# EAGLE schematic Luminant Display Rev. 2.0 Build 5 (FINAL) (EAGLE 6.4), part 1 of 7
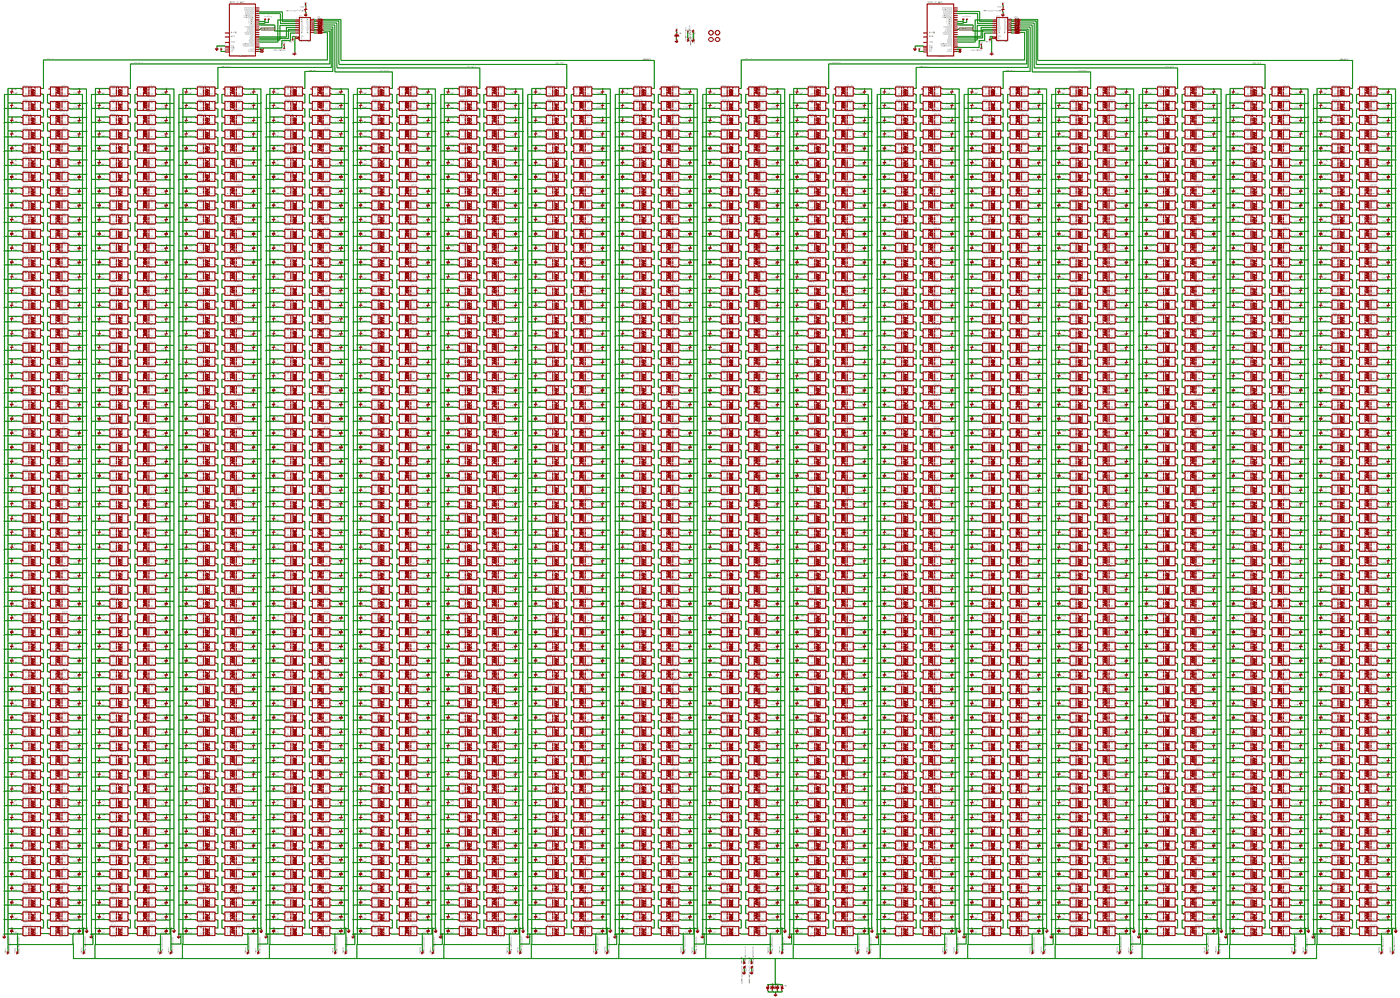
[diagram p0: schematic, sheet 1, overview]
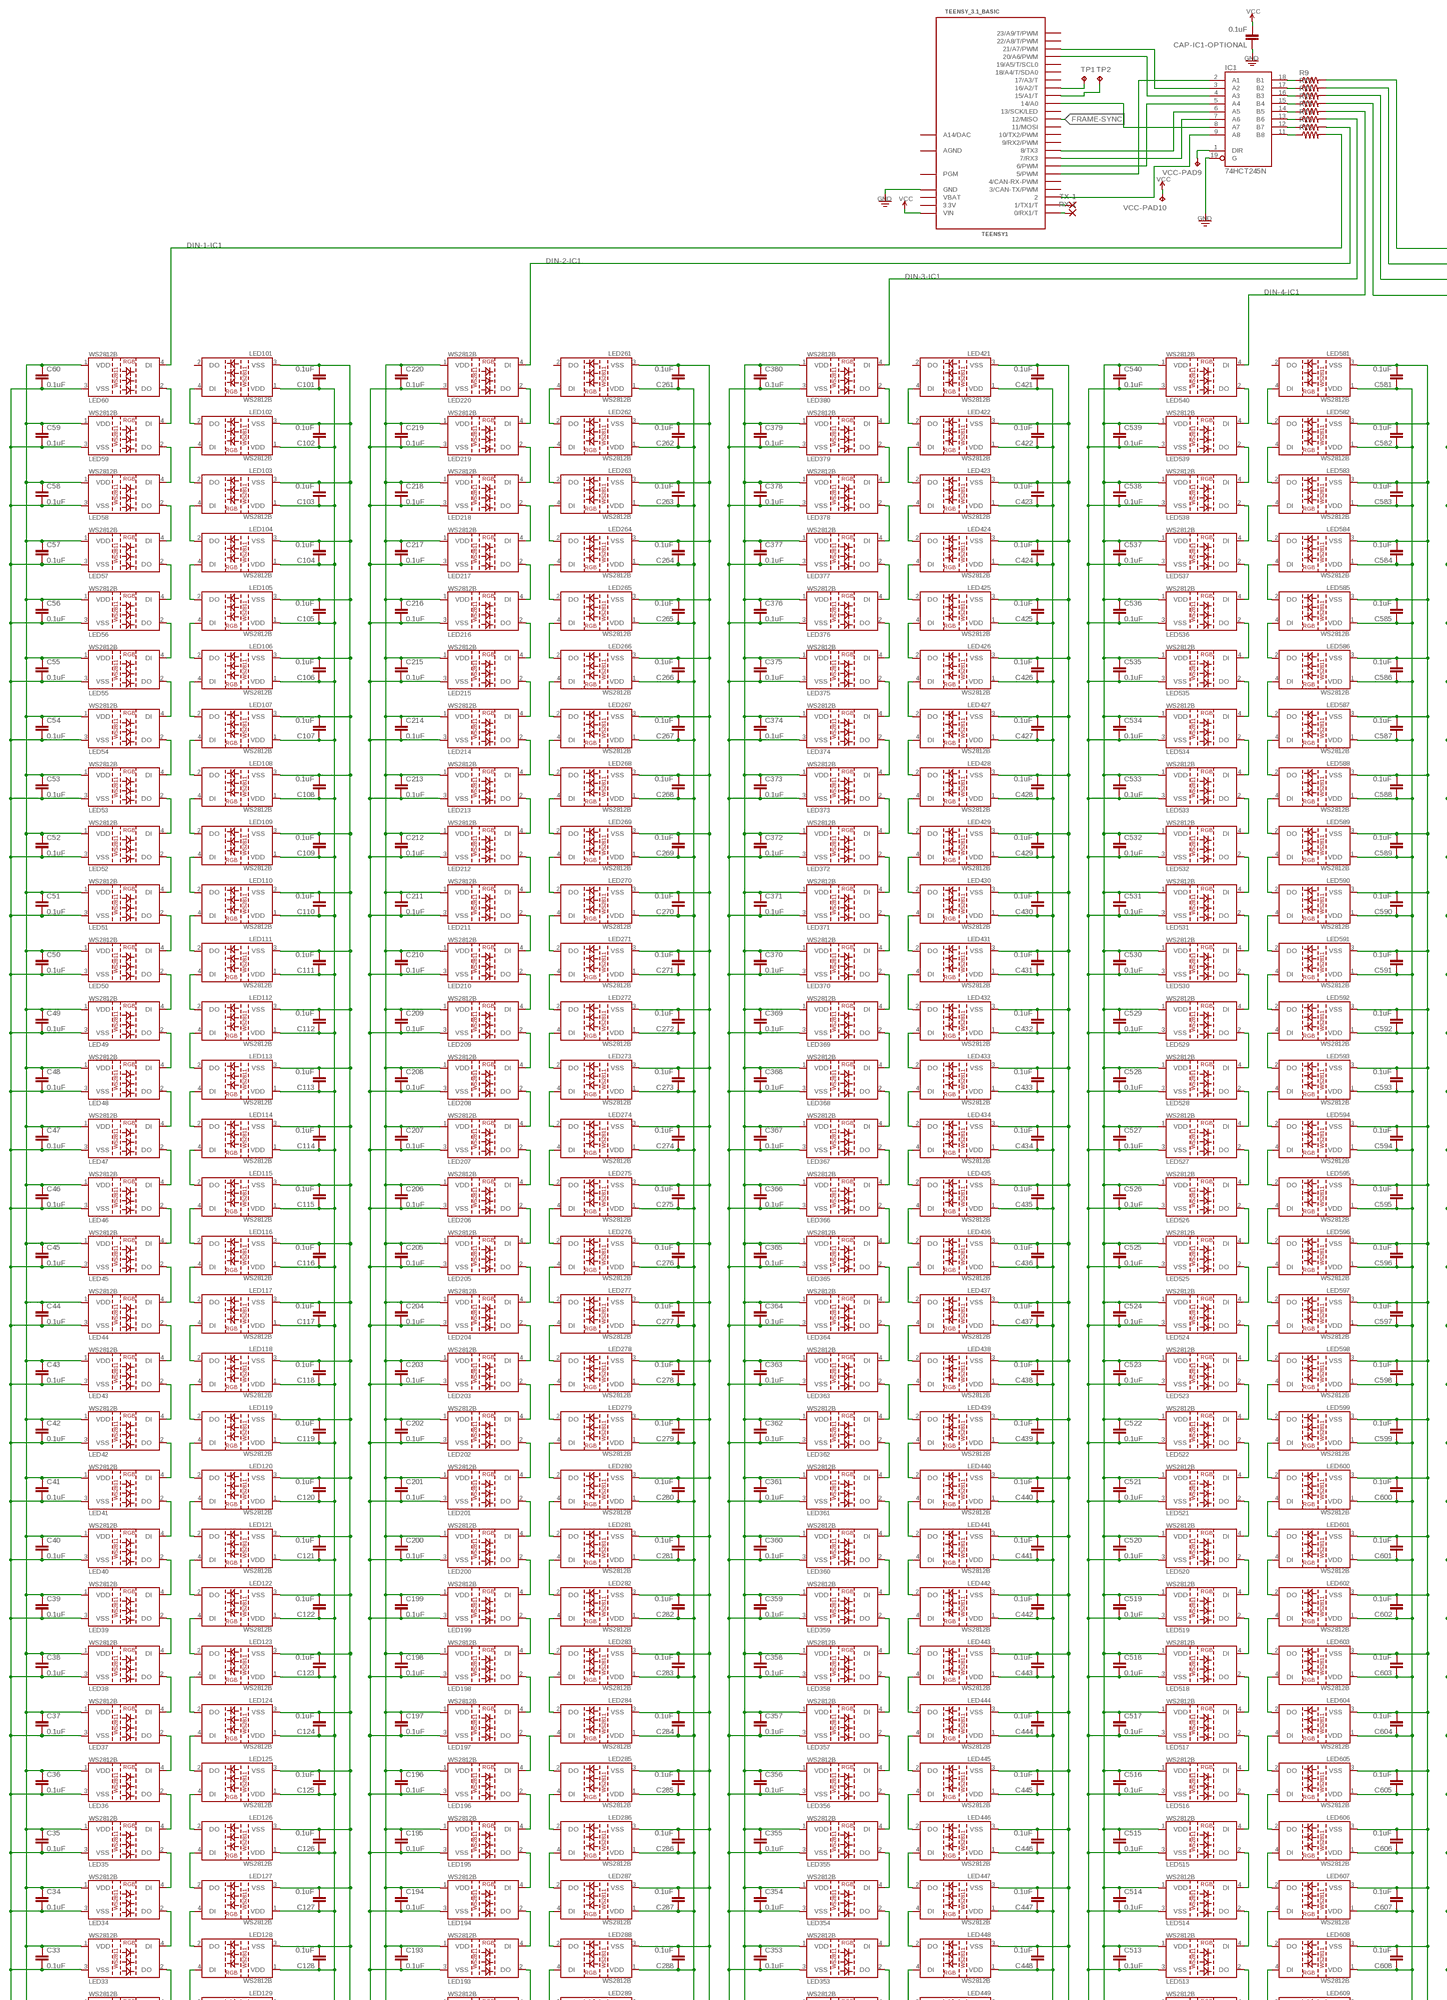
[diagram p1: schematic, sheet 1, part 1 of 8]
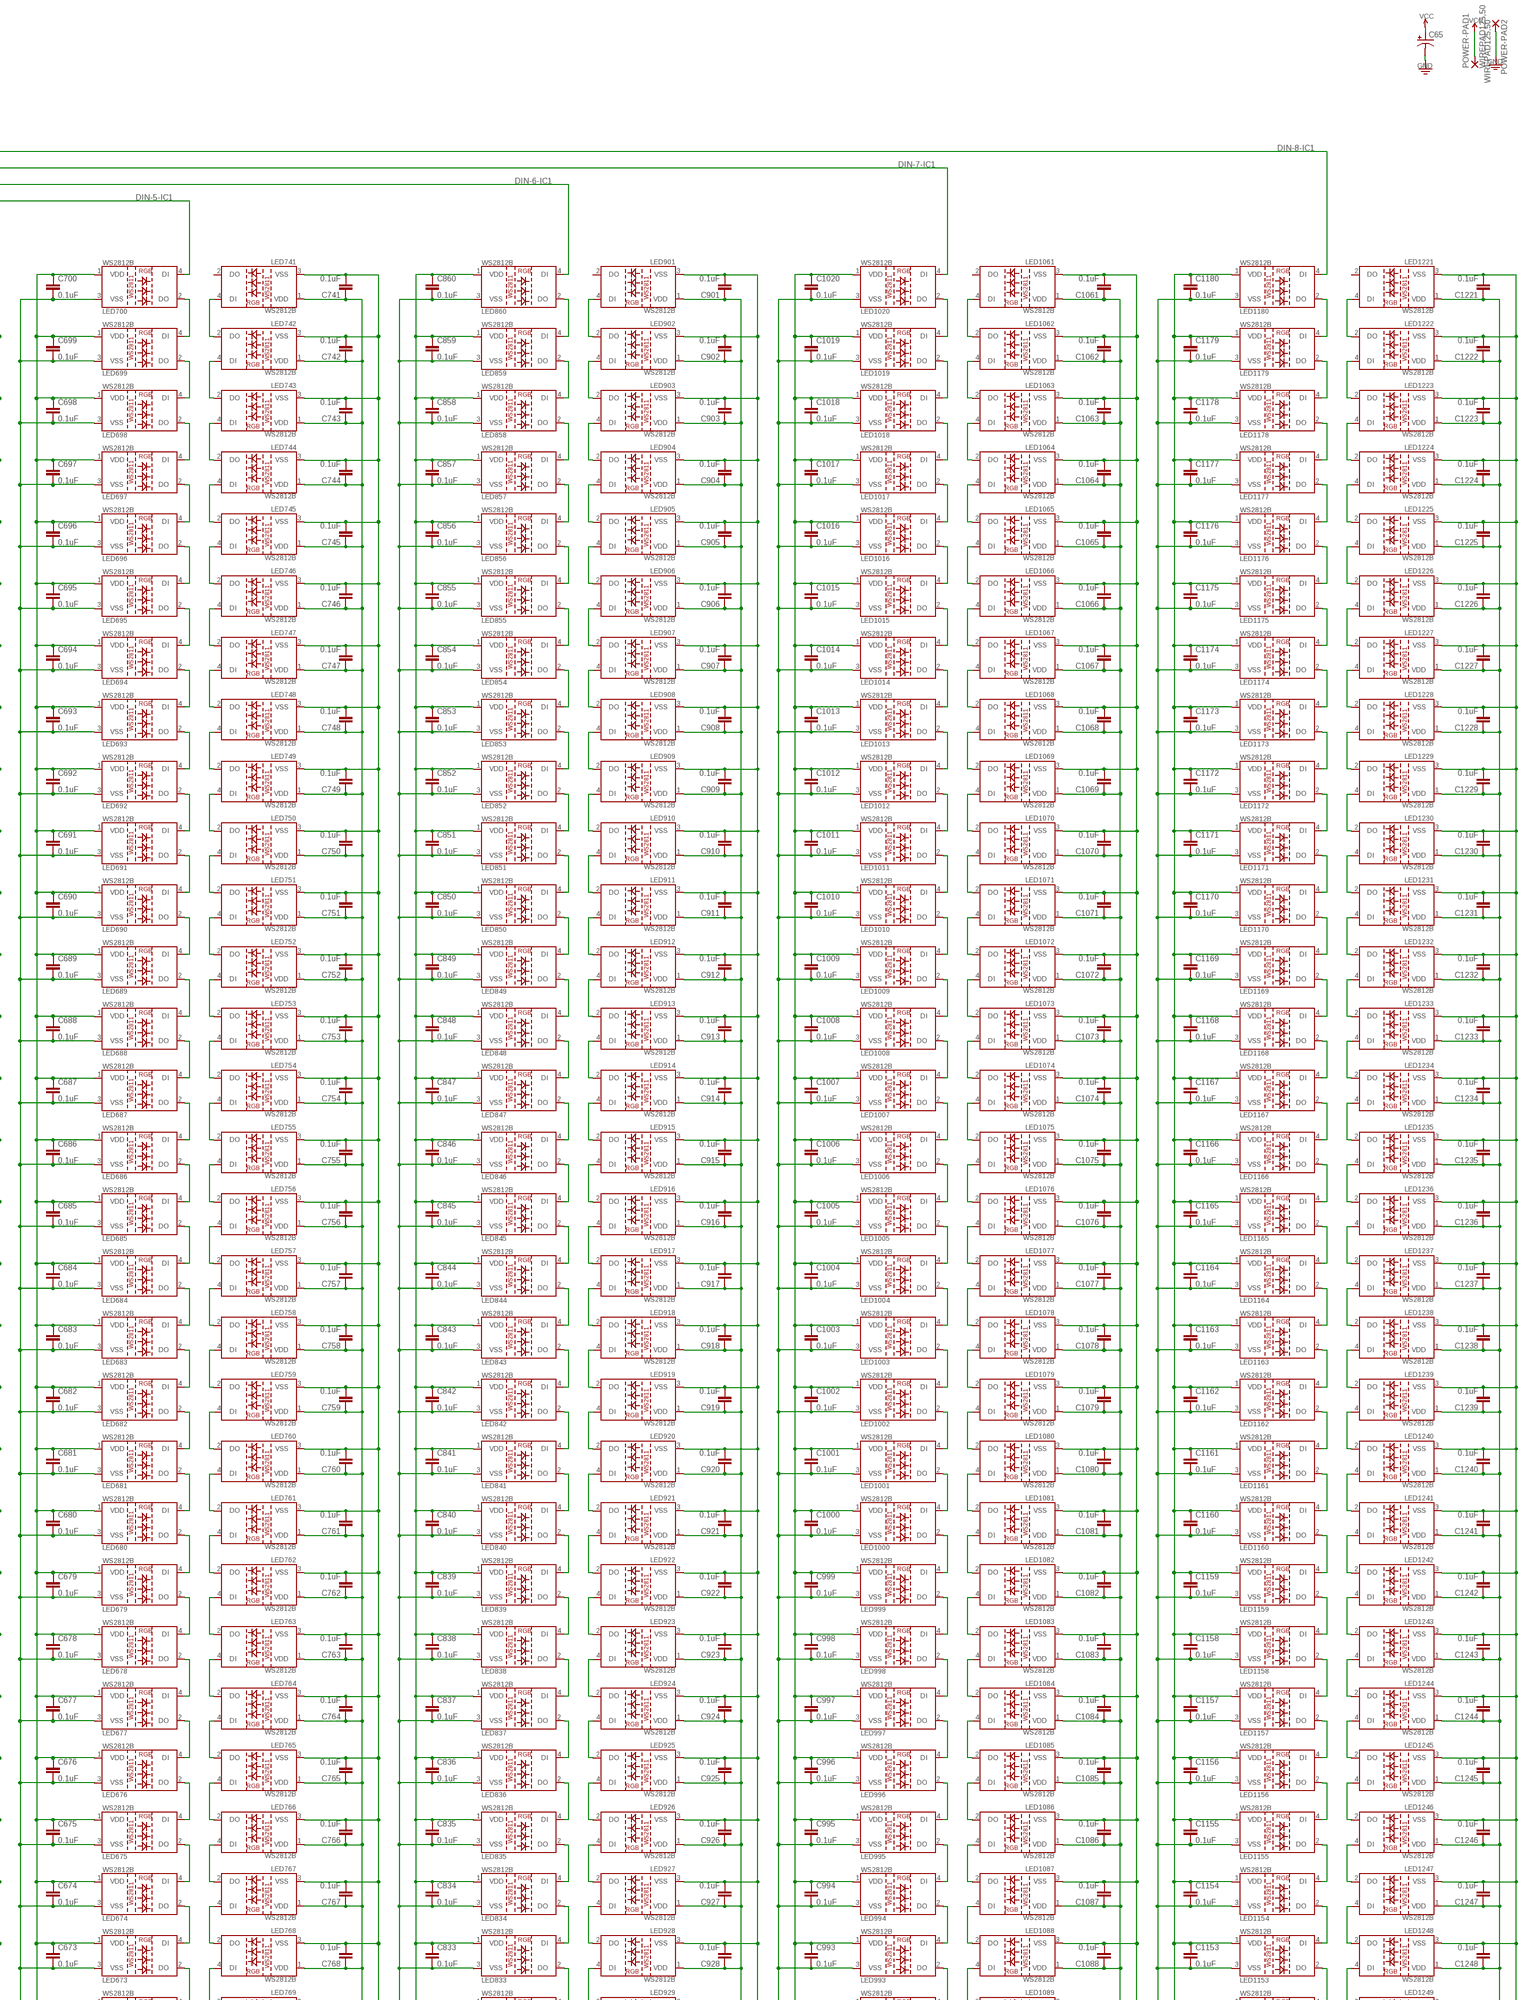
[diagram p2: schematic, sheet 1, part 2 of 8]
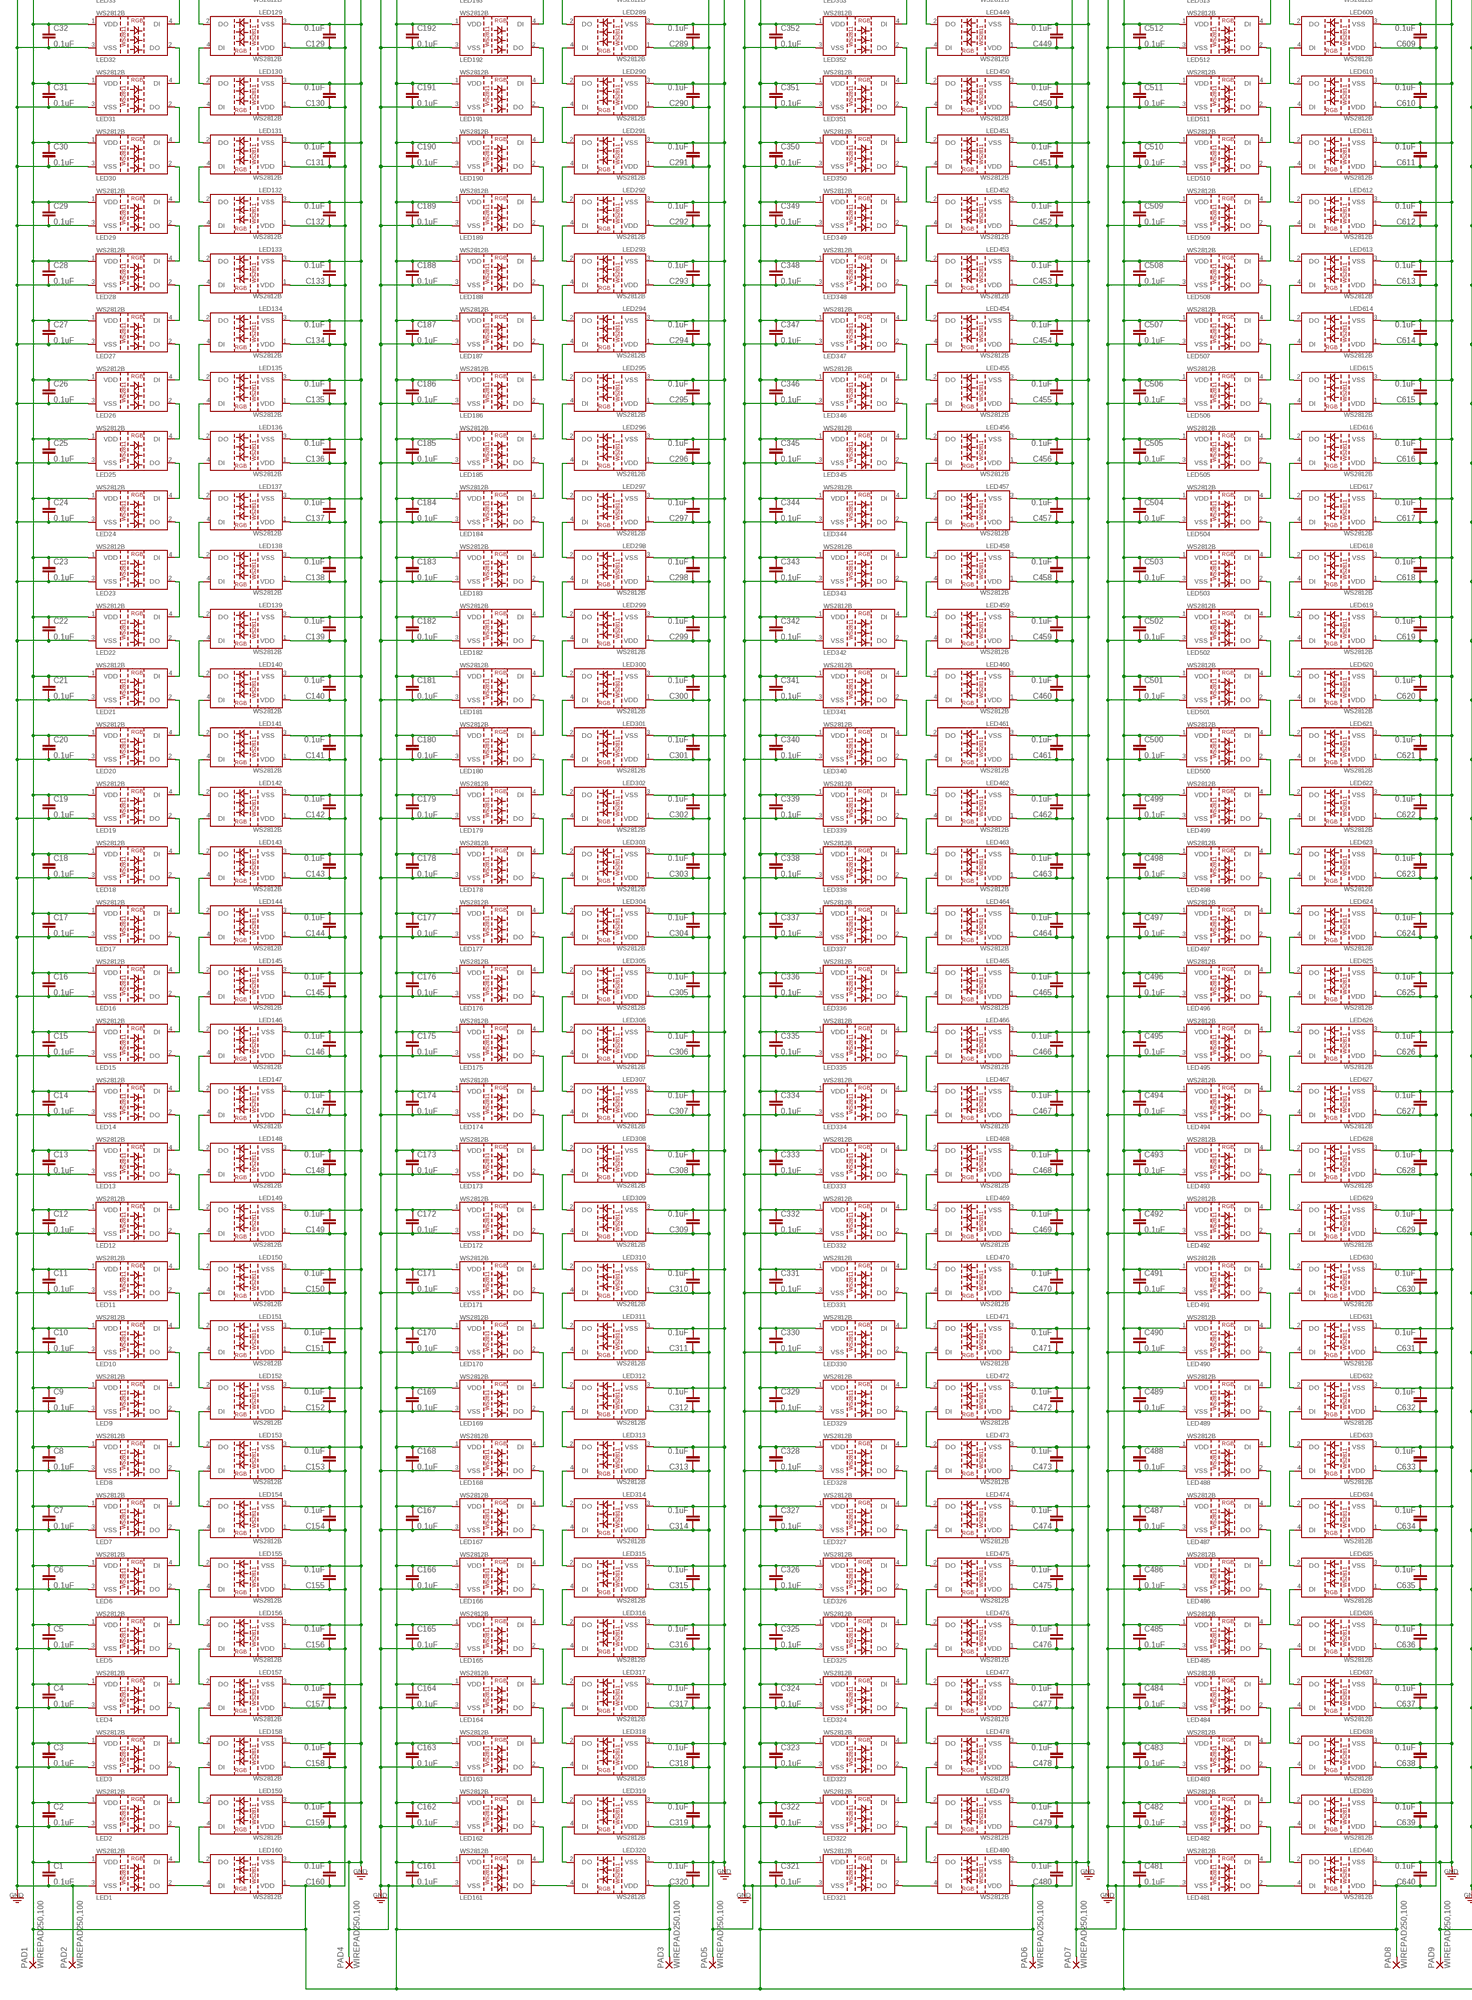
[diagram p3: schematic, sheet 1, part 3 of 8]
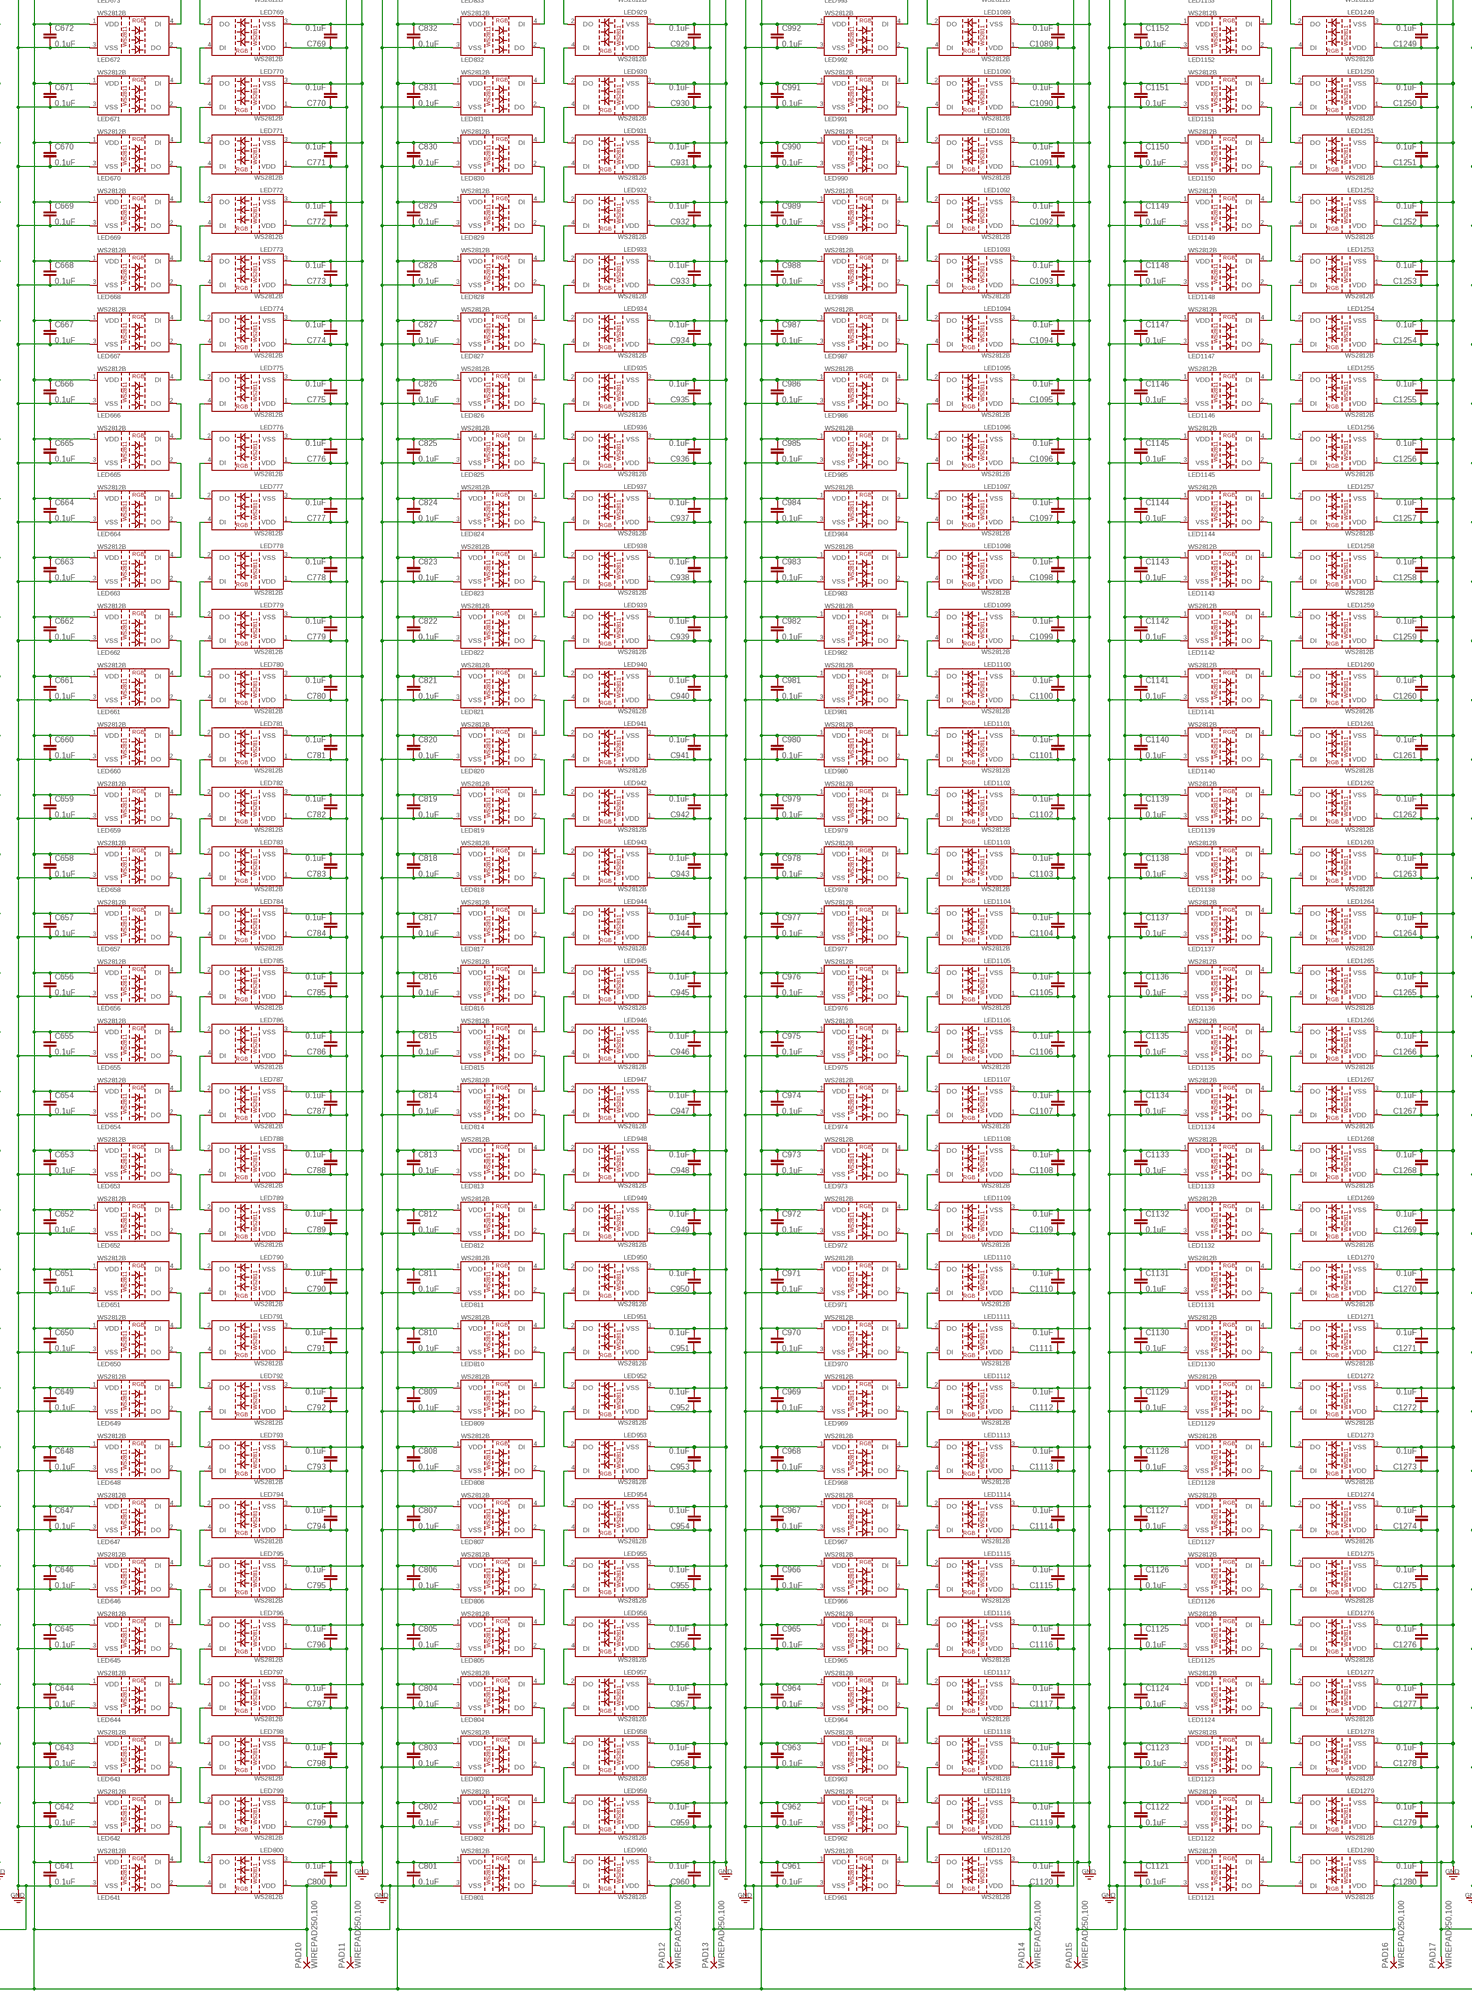
[diagram p4: schematic, sheet 1, part 4 of 8]
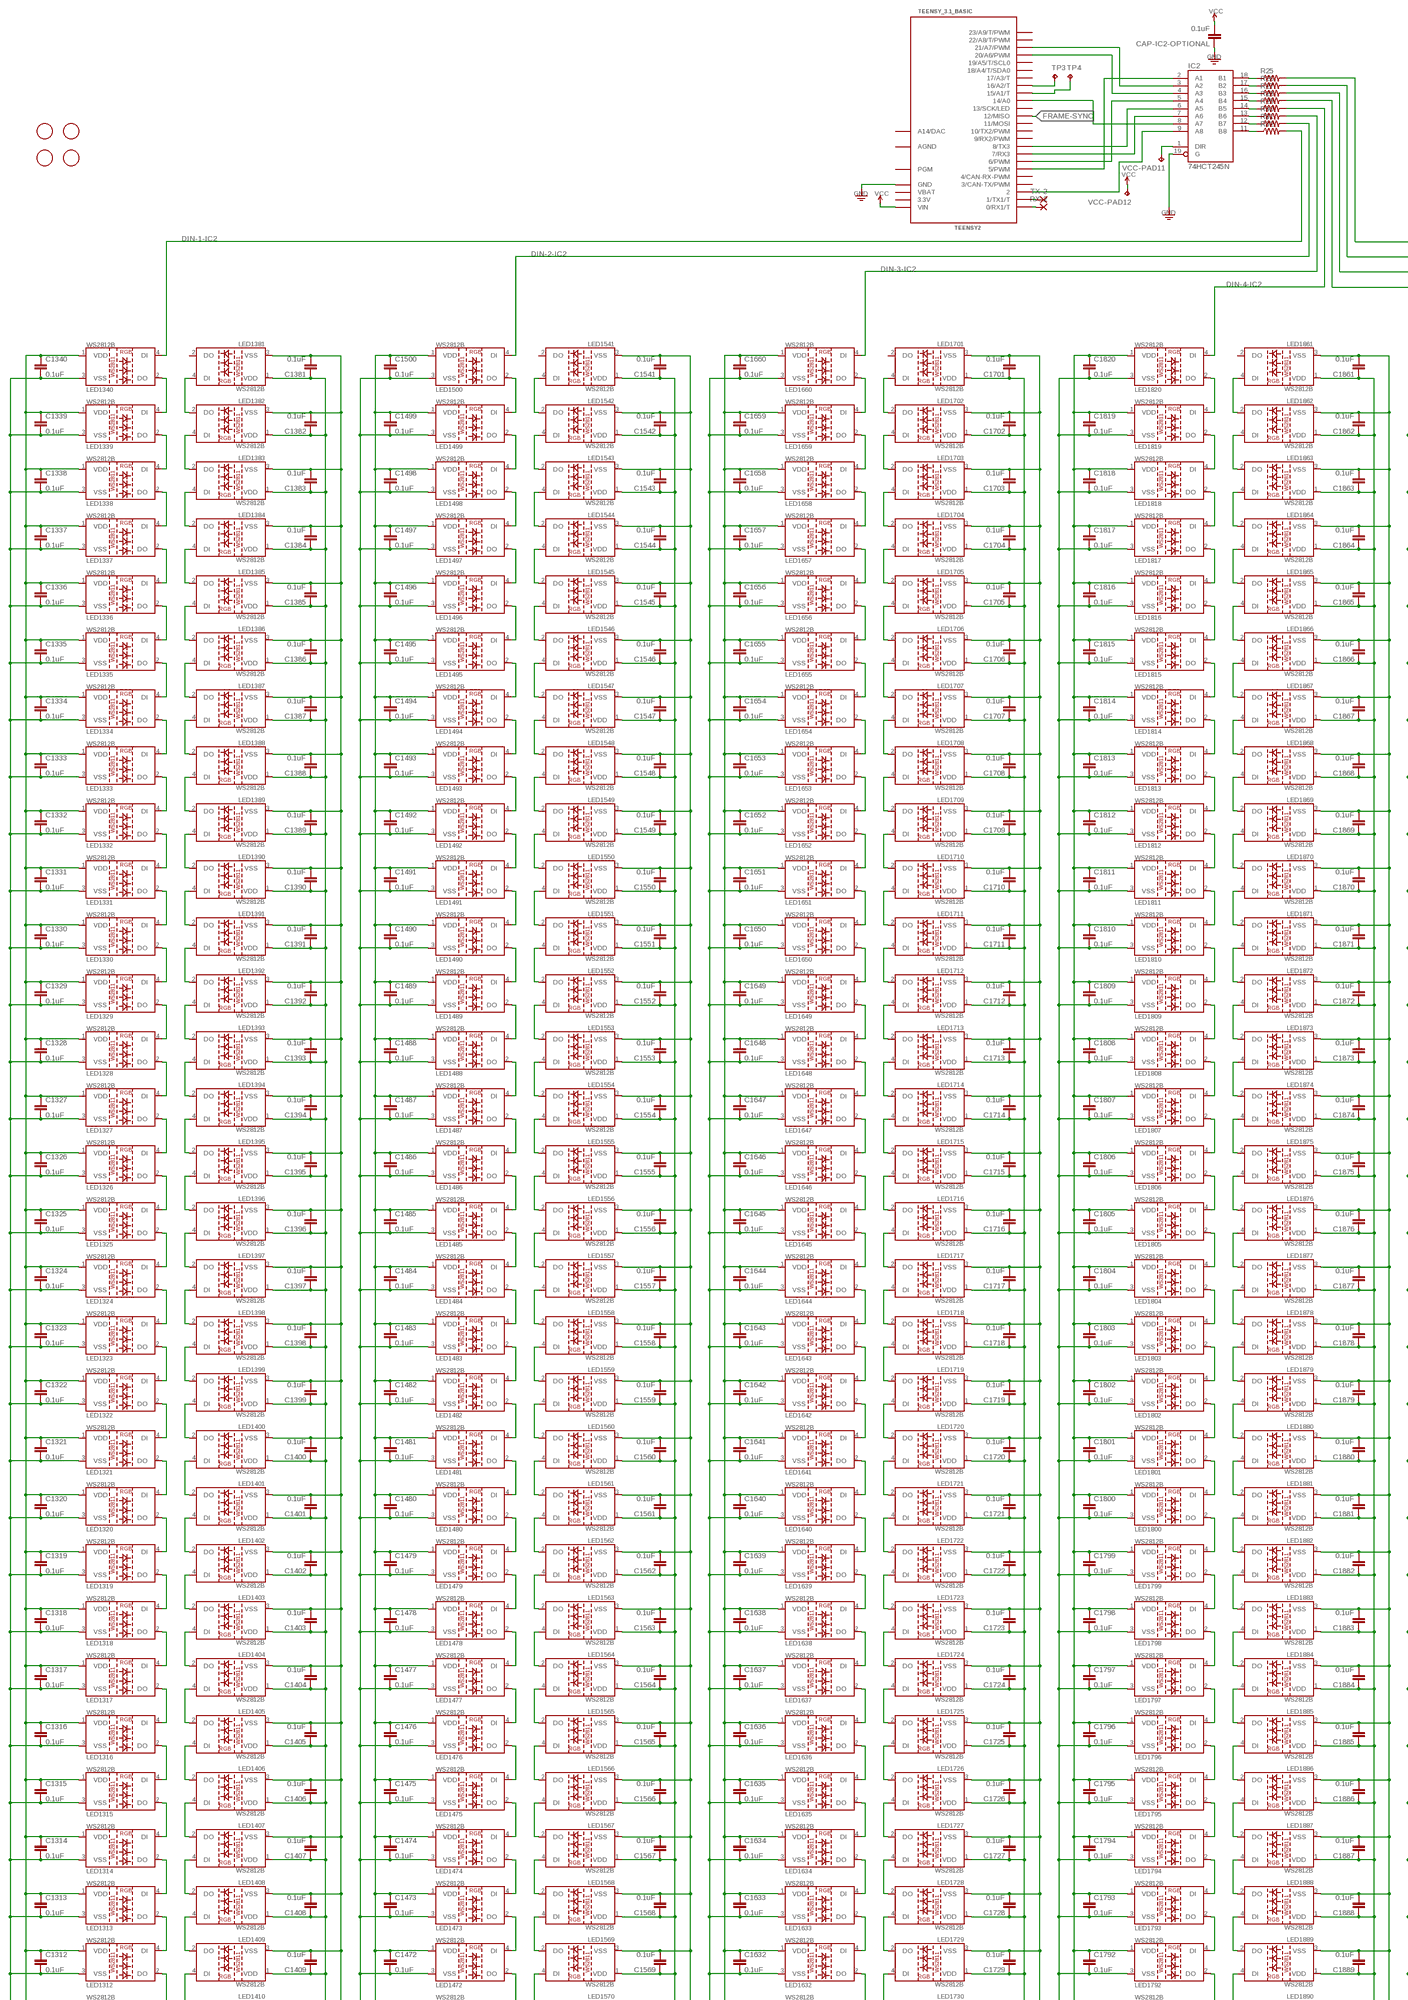
[diagram p5: schematic, sheet 1, part 5 of 8]
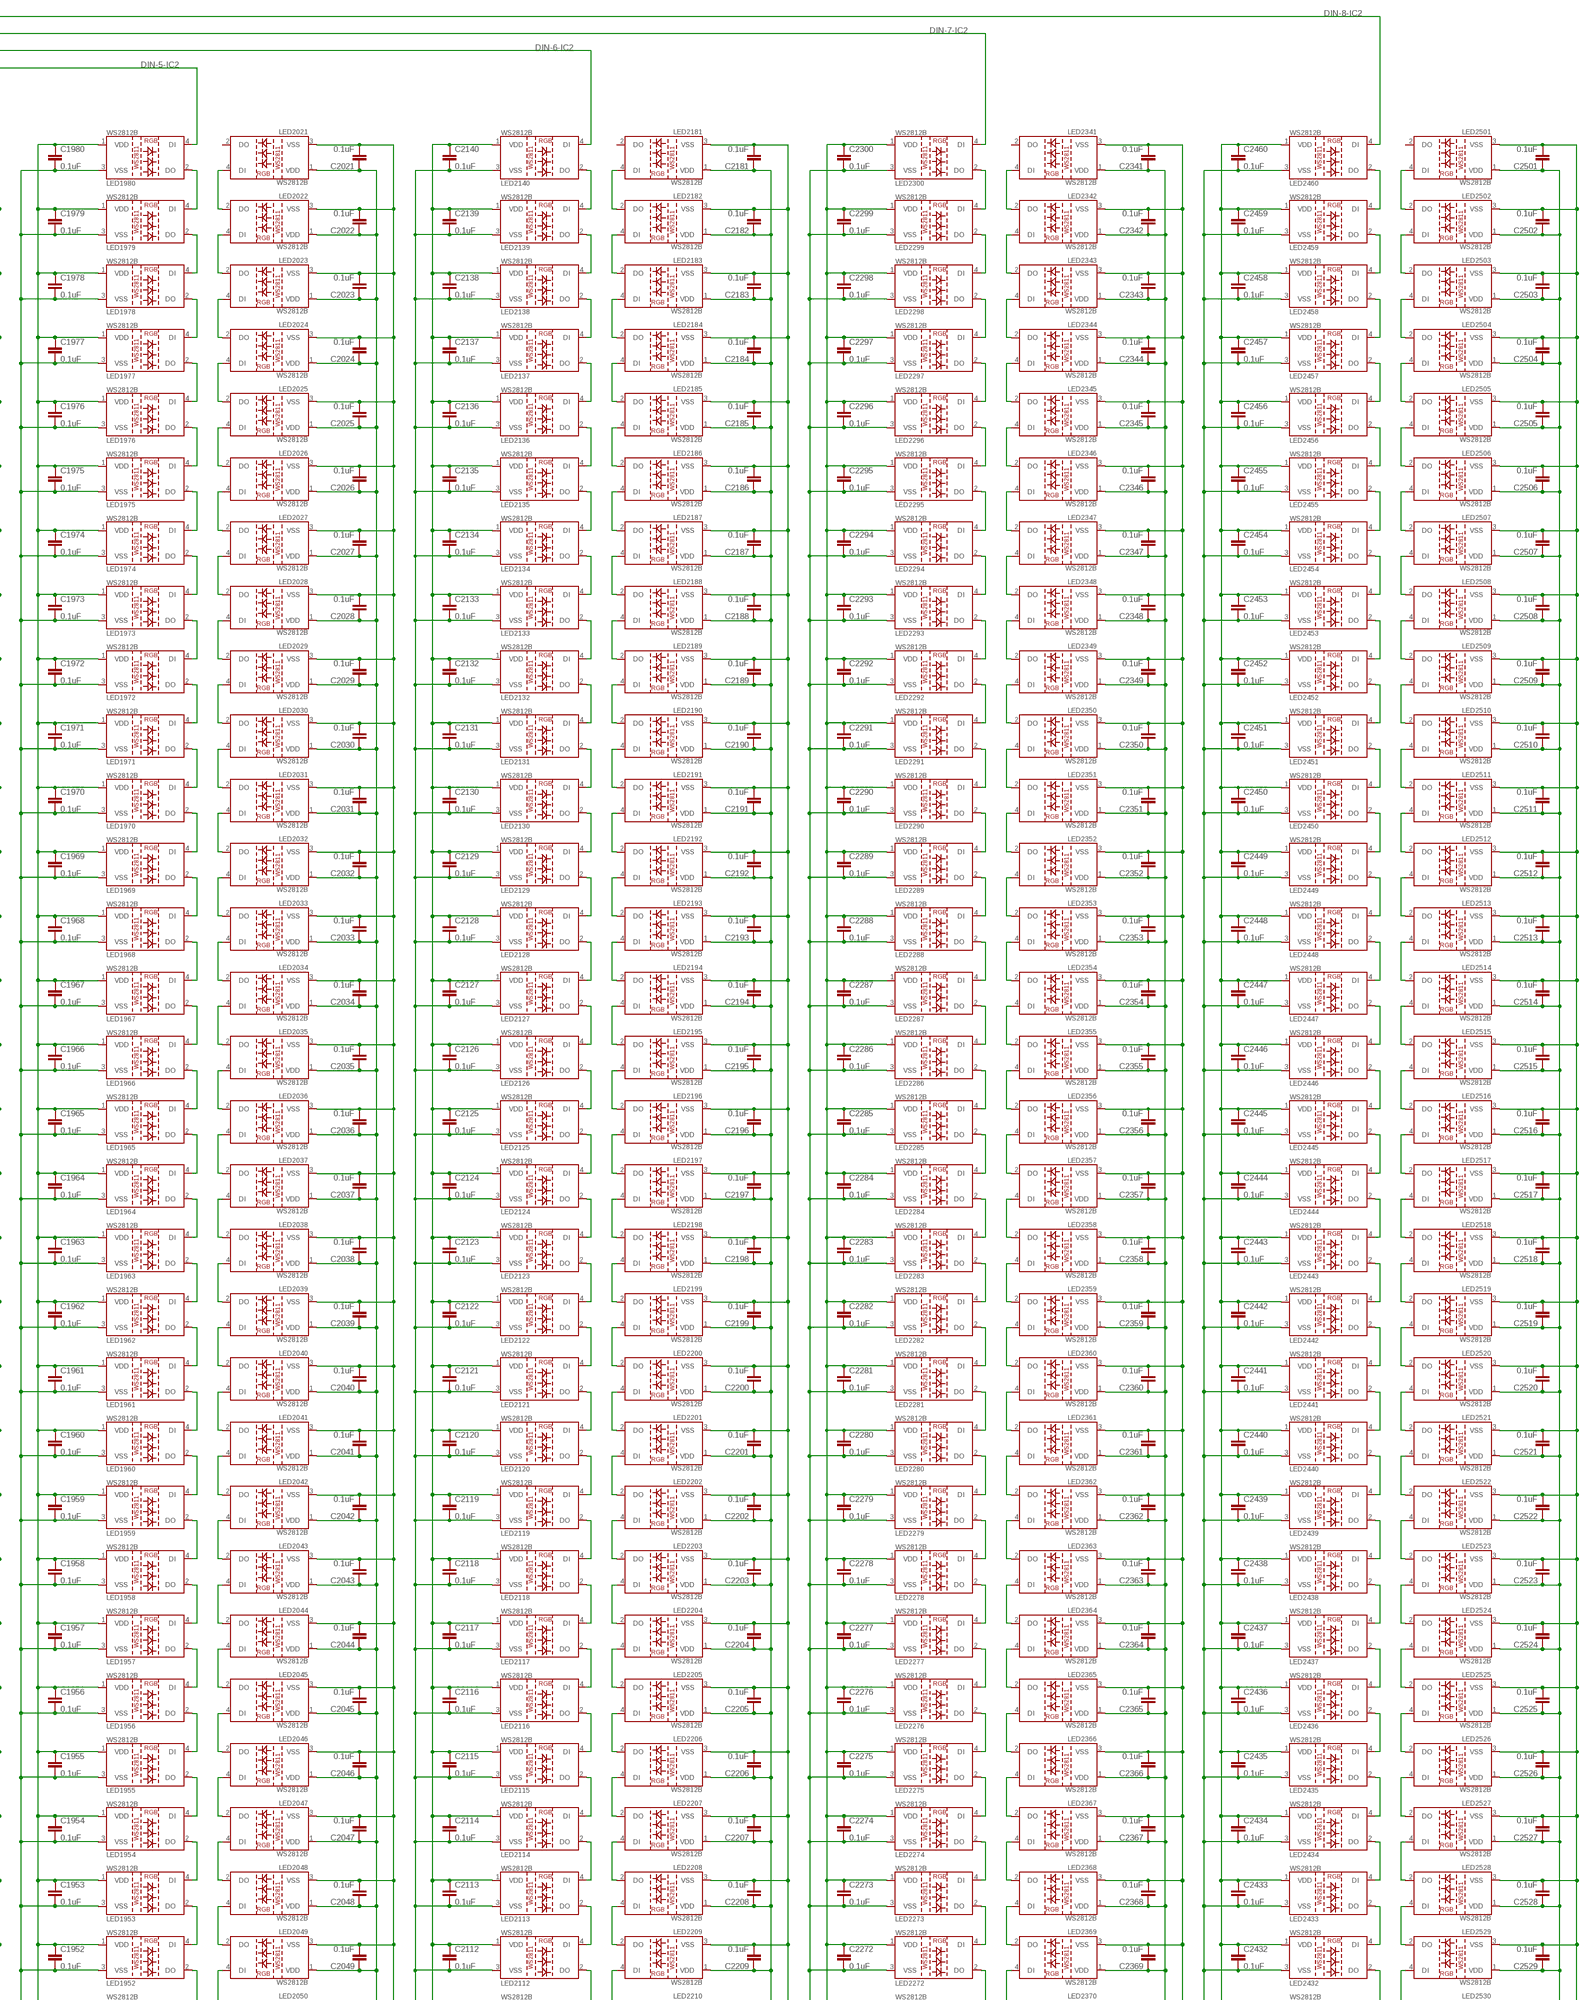
[diagram p6: schematic, sheet 1, part 6 of 8]
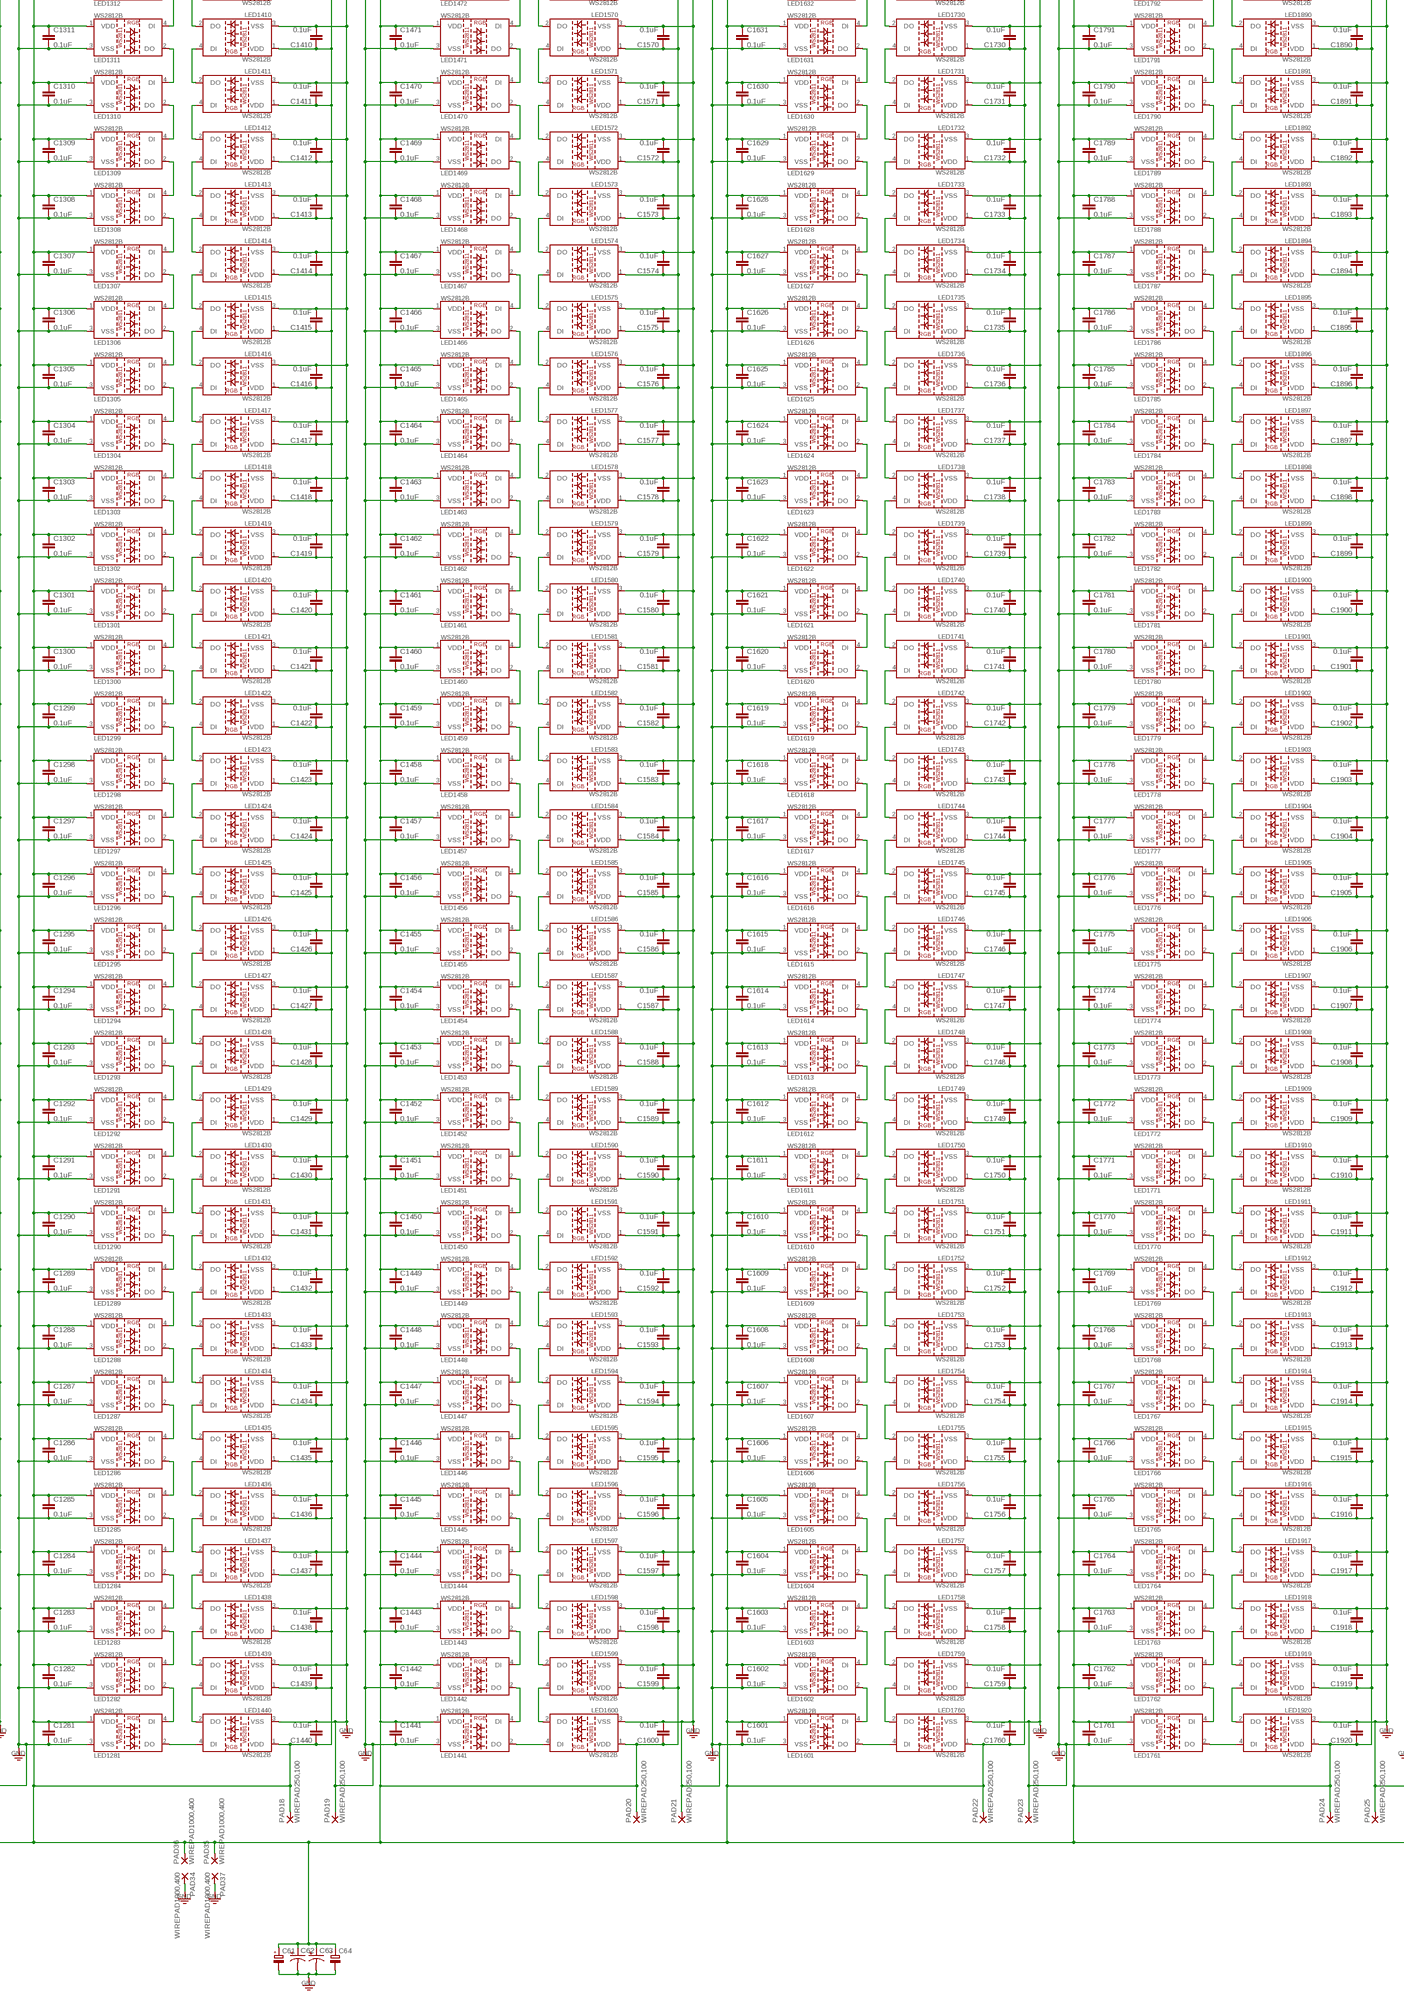
[diagram p7: schematic, sheet 1, part 7 of 8]
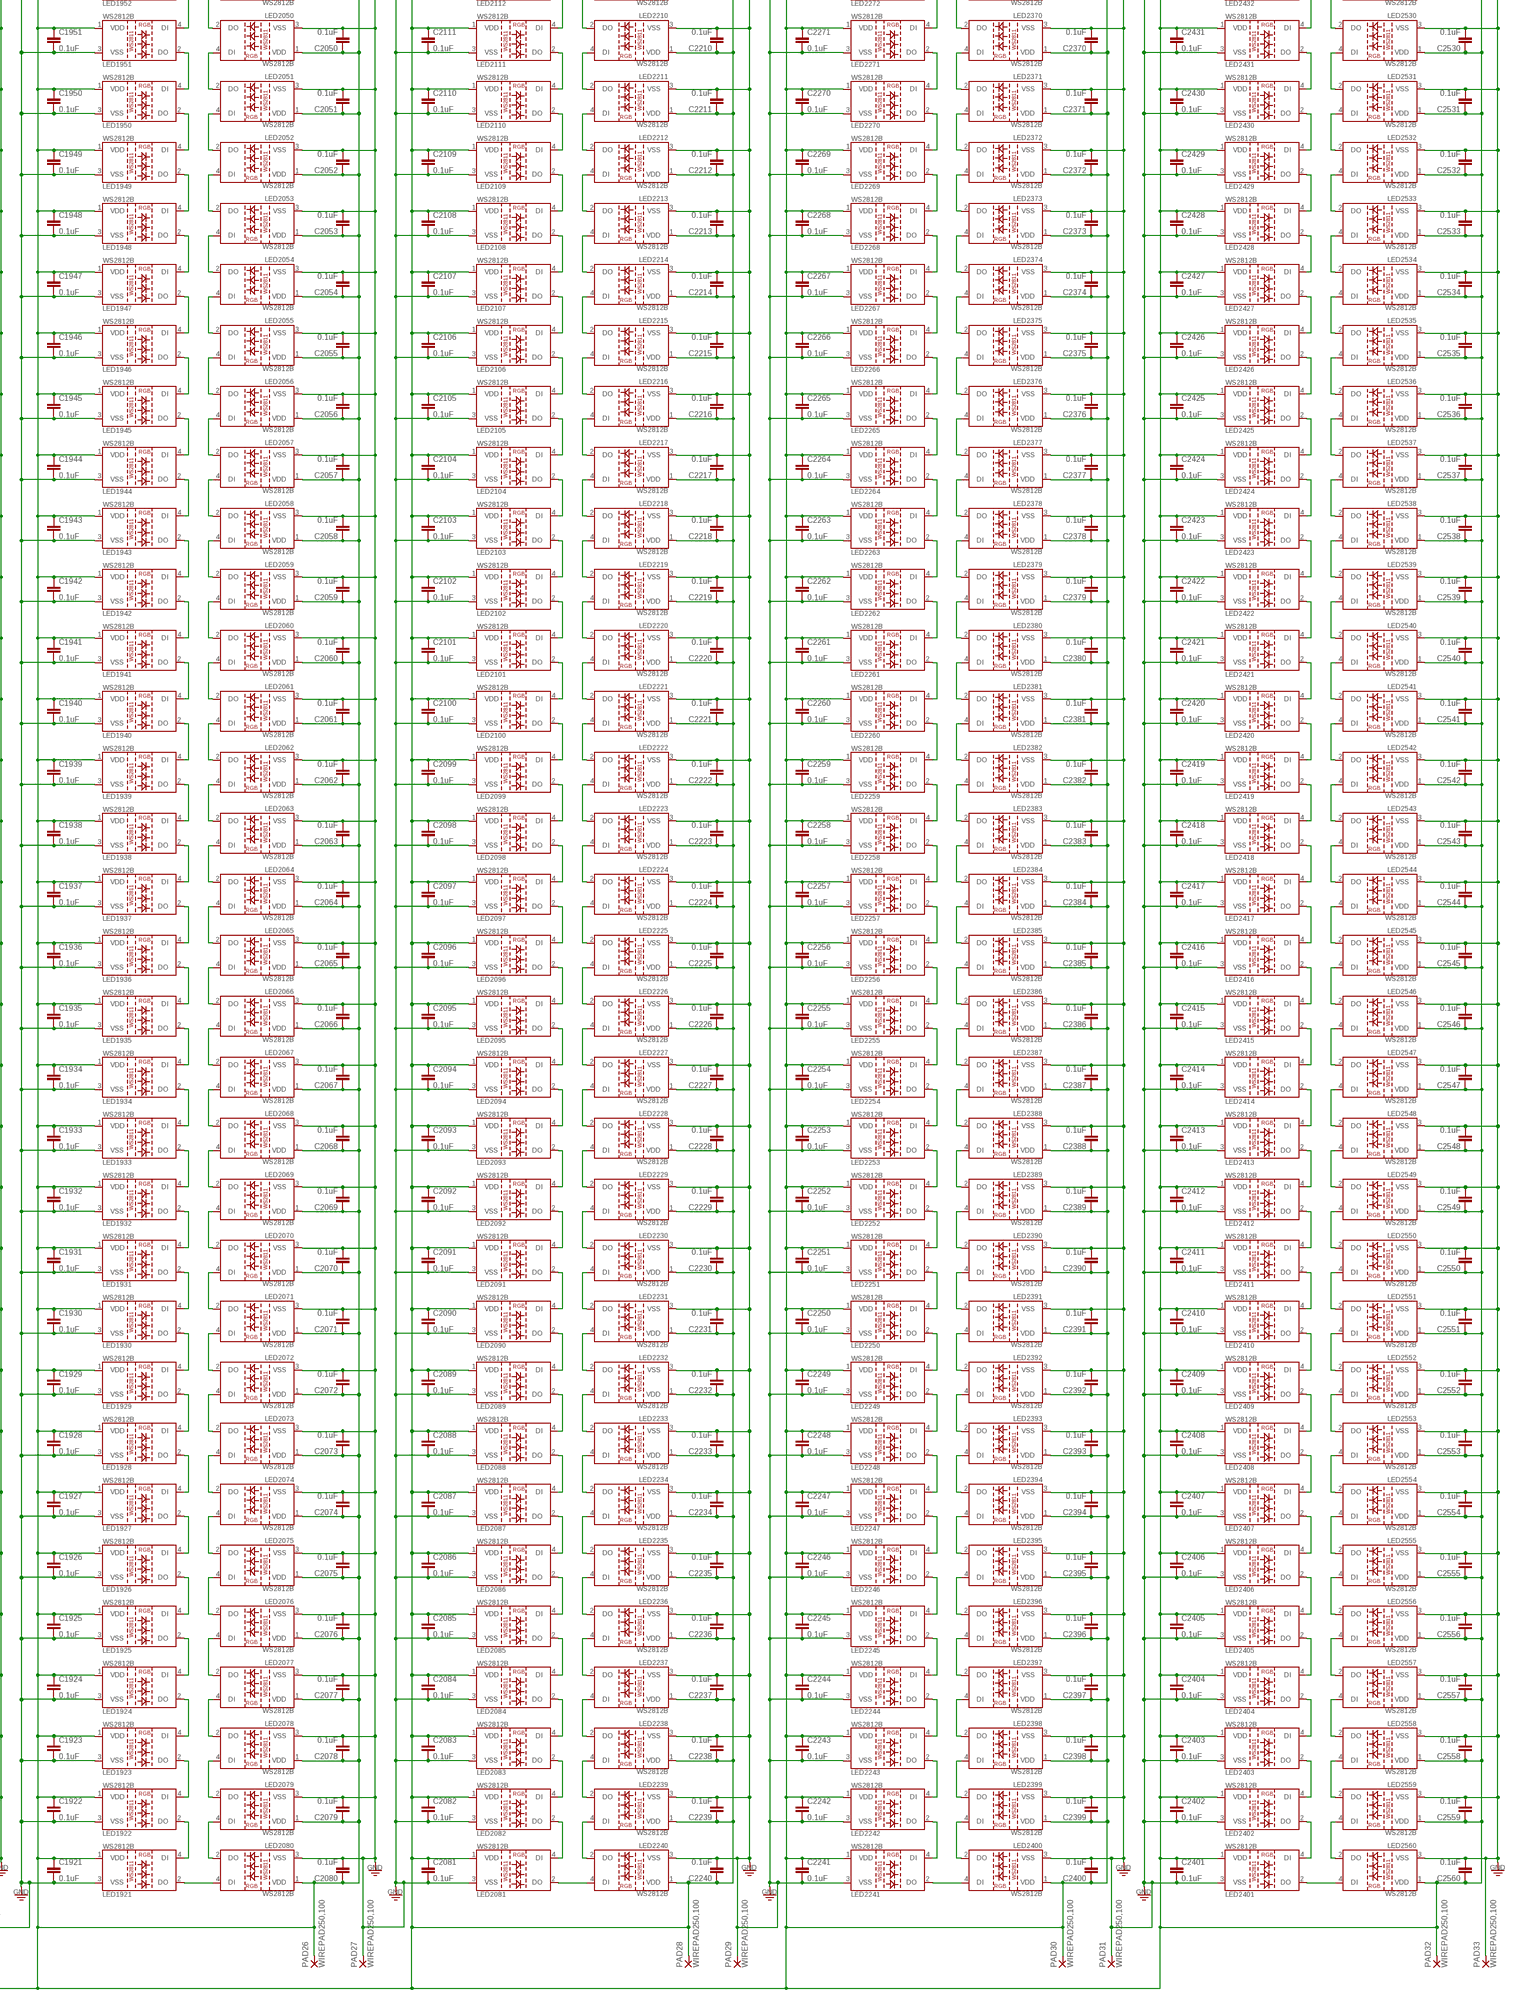
[diagram p8: schematic, sheet 1, part 8 of 8]

## Parts
C1  0.1uF  CAP0805  [0805]
C2  0.1uF  CAP0805  [0805]
C3  0.1uF  CAP0805  [0805]
C4  0.1uF  CAP0805  [0805]
C5  0.1uF  CAP0805  [0805]
C6  0.1uF  CAP0805  [0805]
C7  0.1uF  CAP0805  [0805]
C8  0.1uF  CAP0805  [0805]
C9  0.1uF  CAP0805  [0805]
C10  0.1uF  CAP0805  [0805]
C11  0.1uF  CAP0805  [0805]
C12  0.1uF  CAP0805  [0805]
C13  0.1uF  CAP0805  [0805]
C14  0.1uF  CAP0805  [0805]
C15  0.1uF  CAP0805  [0805]
C16  0.1uF  CAP0805  [0805]
C17  0.1uF  CAP0805  [0805]
C18  0.1uF  CAP0805  [0805]
C19  0.1uF  CAP0805  [0805]
C20  0.1uF  CAP0805  [0805]
C21  0.1uF  CAP0805  [0805]
C22  0.1uF  CAP0805  [0805]
C23  0.1uF  CAP0805  [0805]
C24  0.1uF  CAP0805  [0805]
C25  0.1uF  CAP0805  [0805]
C26  0.1uF  CAP0805  [0805]
C27  0.1uF  CAP0805  [0805]
C28  0.1uF  CAP0805  [0805]
C29  0.1uF  CAP0805  [0805]
C30  0.1uF  CAP0805  [0805]
C31  0.1uF  CAP0805  [0805]
C32  0.1uF  CAP0805  [0805]
C33  0.1uF  CAP0805  [0805]
C34  0.1uF  CAP0805  [0805]
C35  0.1uF  CAP0805  [0805]
C36  0.1uF  CAP0805  [0805]
C37  0.1uF  CAP0805  [0805]
C38  0.1uF  CAP0805  [0805]
C39  0.1uF  CAP0805  [0805]
C40  0.1uF  CAP0805  [0805]
C41  0.1uF  CAP0805  [0805]
C42  0.1uF  CAP0805  [0805]
C43  0.1uF  CAP0805  [0805]
C44  0.1uF  CAP0805  [0805]
C45  0.1uF  CAP0805  [0805]
C46  0.1uF  CAP0805  [0805]
C47  0.1uF  CAP0805  [0805]
C48  0.1uF  CAP0805  [0805]
C49  0.1uF  CAP0805  [0805]
C50  0.1uF  CAP0805  [0805]
C51  0.1uF  CAP0805  [0805]
C52  0.1uF  CAP0805  [0805]
C53  0.1uF  CAP0805  [0805]
C54  0.1uF  CAP0805  [0805]
C55  0.1uF  CAP0805  [0805]
C56  0.1uF  CAP0805  [0805]
C57  0.1uF  CAP0805  [0805]
C58  0.1uF  CAP0805  [0805]
C59  0.1uF  CAP0805  [0805]
C60  0.1uF  CAP0805  [0805]
C61  CPOL-EU-PANASONIC_FK_V_H  [PANASONIC_FK_V_H]
C62  CAP_POLE  [PANASONIC_E]
C63  CAP_POLE  [PANASONIC_E]
C64  CPOL-EU-PANASONIC_FK_V_H  [PANASONIC_FK_V_H]
C65  CAP_POLC  [PANASONIC_C]
C101  0.1uF  CAP0805  [0805]
C102  0.1uF  CAP0805  [0805]
C103  0.1uF  CAP0805  [0805]
C104  0.1uF  CAP0805  [0805]
C105  0.1uF  CAP0805  [0805]
C106  0.1uF  CAP0805  [0805]
C107  0.1uF  CAP0805  [0805]
C108  0.1uF  CAP0805  [0805]
C109  0.1uF  CAP0805  [0805]
C110  0.1uF  CAP0805  [0805]
C111  0.1uF  CAP0805  [0805]
C112  0.1uF  CAP0805  [0805]
C113  0.1uF  CAP0805  [0805]
C114  0.1uF  CAP0805  [0805]
C115  0.1uF  CAP0805  [0805]
C116  0.1uF  CAP0805  [0805]
C117  0.1uF  CAP0805  [0805]
C118  0.1uF  CAP0805  [0805]
C119  0.1uF  CAP0805  [0805]
C120  0.1uF  CAP0805  [0805]
C121  0.1uF  CAP0805  [0805]
C122  0.1uF  CAP0805  [0805]
C123  0.1uF  CAP0805  [0805]
C124  0.1uF  CAP0805  [0805]
C125  0.1uF  CAP0805  [0805]
C126  0.1uF  CAP0805  [0805]
C127  0.1uF  CAP0805  [0805]
C128  0.1uF  CAP0805  [0805]
C129  0.1uF  CAP0805  [0805]
C130  0.1uF  CAP0805  [0805]
C131  0.1uF  CAP0805  [0805]
C132  0.1uF  CAP0805  [0805]
C133  0.1uF  CAP0805  [0805]
C134  0.1uF  CAP0805  [0805]
C135  0.1uF  CAP0805  [0805]
C136  0.1uF  CAP0805  [0805]
C137  0.1uF  CAP0805  [0805]
C138  0.1uF  CAP0805  [0805]
C139  0.1uF  CAP0805  [0805]
C140  0.1uF  CAP0805  [0805]
C141  0.1uF  CAP0805  [0805]
C142  0.1uF  CAP0805  [0805]
C143  0.1uF  CAP0805  [0805]
C144  0.1uF  CAP0805  [0805]
C145  0.1uF  CAP0805  [0805]
C146  0.1uF  CAP0805  [0805]
C147  0.1uF  CAP0805  [0805]
C148  0.1uF  CAP0805  [0805]
C149  0.1uF  CAP0805  [0805]
C150  0.1uF  CAP0805  [0805]
C151  0.1uF  CAP0805  [0805]
C152  0.1uF  CAP0805  [0805]
C153  0.1uF  CAP0805  [0805]
C154  0.1uF  CAP0805  [0805]
C155  0.1uF  CAP0805  [0805]
C156  0.1uF  CAP0805  [0805]
C157  0.1uF  CAP0805  [0805]
C158  0.1uF  CAP0805  [0805]
C159  0.1uF  CAP0805  [0805]
C160  0.1uF  CAP0805  [0805]
C161  0.1uF  CAP0805  [0805]
C162  0.1uF  CAP0805  [0805]
C163  0.1uF  CAP0805  [0805]
C164  0.1uF  CAP0805  [0805]
C165  0.1uF  CAP0805  [0805]
C166  0.1uF  CAP0805  [0805]
C167  0.1uF  CAP0805  [0805]
C168  0.1uF  CAP0805  [0805]
C169  0.1uF  CAP0805  [0805]
C170  0.1uF  CAP0805  [0805]
C171  0.1uF  CAP0805  [0805]
C172  0.1uF  CAP0805  [0805]
C173  0.1uF  CAP0805  [0805]
C174  0.1uF  CAP0805  [0805]
C175  0.1uF  CAP0805  [0805]
C176  0.1uF  CAP0805  [0805]
C177  0.1uF  CAP0805  [0805]
C178  0.1uF  CAP0805  [0805]
C179  0.1uF  CAP0805  [0805]
C180  0.1uF  CAP0805  [0805]
C181  0.1uF  CAP0805  [0805]
C182  0.1uF  CAP0805  [0805]
C183  0.1uF  CAP0805  [0805]
C184  0.1uF  CAP0805  [0805]
C185  0.1uF  CAP0805  [0805]
C186  0.1uF  CAP0805  [0805]
C187  0.1uF  CAP0805  [0805]
C188  0.1uF  CAP0805  [0805]
C189  0.1uF  CAP0805  [0805]
C190  0.1uF  CAP0805  [0805]
C191  0.1uF  CAP0805  [0805]
C192  0.1uF  CAP0805  [0805]
C193  0.1uF  CAP0805  [0805]
C194  0.1uF  CAP0805  [0805]
C195  0.1uF  CAP0805  [0805]
C196  0.1uF  CAP0805  [0805]
C197  0.1uF  CAP0805  [0805]
C198  0.1uF  CAP0805  [0805]
C199  0.1uF  CAP0805  [0805]
C200  0.1uF  CAP0805  [0805]
C201  0.1uF  CAP0805  [0805]
C202  0.1uF  CAP0805  [0805]
C203  0.1uF  CAP0805  [0805]
C204  0.1uF  CAP0805  [0805]
C205  0.1uF  CAP0805  [0805]
C206  0.1uF  CAP0805  [0805]
C207  0.1uF  CAP0805  [0805]
C208  0.1uF  CAP0805  [0805]
C209  0.1uF  CAP0805  [0805]
C210  0.1uF  CAP0805  [0805]
C211  0.1uF  CAP0805  [0805]
C212  0.1uF  CAP0805  [0805]
C213  0.1uF  CAP0805  [0805]
C214  0.1uF  CAP0805  [0805]
C215  0.1uF  CAP0805  [0805]
C216  0.1uF  CAP0805  [0805]
C217  0.1uF  CAP0805  [0805]
C218  0.1uF  CAP0805  [0805]
C219  0.1uF  CAP0805  [0805]
C220  0.1uF  CAP0805  [0805]
C261  0.1uF  CAP0805  [0805]
C262  0.1uF  CAP0805  [0805]
C263  0.1uF  CAP0805  [0805]
C264  0.1uF  CAP0805  [0805]
C265  0.1uF  CAP0805  [0805]
C266  0.1uF  CAP0805  [0805]
C267  0.1uF  CAP0805  [0805]
C268  0.1uF  CAP0805  [0805]
C269  0.1uF  CAP0805  [0805]
C270  0.1uF  CAP0805  [0805]
C271  0.1uF  CAP0805  [0805]
C272  0.1uF  CAP0805  [0805]
C273  0.1uF  CAP0805  [0805]
C274  0.1uF  CAP0805  [0805]
C275  0.1uF  CAP0805  [0805]
C276  0.1uF  CAP0805  [0805]
C277  0.1uF  CAP0805  [0805]
C278  0.1uF  CAP0805  [0805]
C279  0.1uF  CAP0805  [0805]
C280  0.1uF  CAP0805  [0805]
C281  0.1uF  CAP0805  [0805]
C282  0.1uF  CAP0805  [0805]
C283  0.1uF  CAP0805  [0805]
C284  0.1uF  CAP0805  [0805]
C285  0.1uF  CAP0805  [0805]
C286  0.1uF  CAP0805  [0805]
C287  0.1uF  CAP0805  [0805]
C288  0.1uF  CAP0805  [0805]
C289  0.1uF  CAP0805  [0805]
C290  0.1uF  CAP0805  [0805]
C291  0.1uF  CAP0805  [0805]
C292  0.1uF  CAP0805  [0805]
C293  0.1uF  CAP0805  [0805]
C294  0.1uF  CAP0805  [0805]
C295  0.1uF  CAP0805  [0805]
C296  0.1uF  CAP0805  [0805]
C297  0.1uF  CAP0805  [0805]
C298  0.1uF  CAP0805  [0805]
C299  0.1uF  CAP0805  [0805]
C300  0.1uF  CAP0805  [0805]
C301  0.1uF  CAP0805  [0805]
C302  0.1uF  CAP0805  [0805]
C303  0.1uF  CAP0805  [0805]
C304  0.1uF  CAP0805  [0805]
C305  0.1uF  CAP0805  [0805]
C306  0.1uF  CAP0805  [0805]
C307  0.1uF  CAP0805  [0805]
C308  0.1uF  CAP0805  [0805]
C309  0.1uF  CAP0805  [0805]
C310  0.1uF  CAP0805  [0805]
C311  0.1uF  CAP0805  [0805]
C312  0.1uF  CAP0805  [0805]
C313  0.1uF  CAP0805  [0805]
C314  0.1uF  CAP0805  [0805]
C315  0.1uF  CAP0805  [0805]
C316  0.1uF  CAP0805  [0805]
C317  0.1uF  CAP0805  [0805]
C318  0.1uF  CAP0805  [0805]
C319  0.1uF  CAP0805  [0805]
C320  0.1uF  CAP0805  [0805]
C321  0.1uF  CAP0805  [0805]
C322  0.1uF  CAP0805  [0805]
C323  0.1uF  CAP0805  [0805]
C324  0.1uF  CAP0805  [0805]
C325  0.1uF  CAP0805  [0805]
C326  0.1uF  CAP0805  [0805]
C327  0.1uF  CAP0805  [0805]
C328  0.1uF  CAP0805  [0805]
C329  0.1uF  CAP0805  [0805]
C330  0.1uF  CAP0805  [0805]
C331  0.1uF  CAP0805  [0805]
C332  0.1uF  CAP0805  [0805]
C333  0.1uF  CAP0805  [0805]
C334  0.1uF  CAP0805  [0805]
C335  0.1uF  CAP0805  [0805]
C336  0.1uF  CAP0805  [0805]
C337  0.1uF  CAP0805  [0805]
C338  0.1uF  CAP0805  [0805]
C339  0.1uF  CAP0805  [0805]
C340  0.1uF  CAP0805  [0805]
C341  0.1uF  CAP0805  [0805]
C342  0.1uF  CAP0805  [0805]
C343  0.1uF  CAP0805  [0805]
C344  0.1uF  CAP0805  [0805]
C345  0.1uF  CAP0805  [0805]
C346  0.1uF  CAP0805  [0805]
C347  0.1uF  CAP0805  [0805]
C348  0.1uF  CAP0805  [0805]
C349  0.1uF  CAP0805  [0805]
C350  0.1uF  CAP0805  [0805]
C351  0.1uF  CAP0805  [0805]
C352  0.1uF  CAP0805  [0805]
C353  0.1uF  CAP0805  [0805]
C354  0.1uF  CAP0805  [0805]
C355  0.1uF  CAP0805  [0805]
C356  0.1uF  CAP0805  [0805]
C357  0.1uF  CAP0805  [0805]
C358  0.1uF  CAP0805  [0805]
C359  0.1uF  CAP0805  [0805]
C360  0.1uF  CAP0805  [0805]
C361  0.1uF  CAP0805  [0805]
C362  0.1uF  CAP0805  [0805]
C363  0.1uF  CAP0805  [0805]
C364  0.1uF  CAP0805  [0805]
C365  0.1uF  CAP0805  [0805]
C366  0.1uF  CAP0805  [0805]
C367  0.1uF  CAP0805  [0805]
C368  0.1uF  CAP0805  [0805]
C369  0.1uF  CAP0805  [0805]
C370  0.1uF  CAP0805  [0805]
C371  0.1uF  CAP0805  [0805]
C372  0.1uF  CAP0805  [0805]
C373  0.1uF  CAP0805  [0805]
C374  0.1uF  CAP0805  [0805]
C375  0.1uF  CAP0805  [0805]
C376  0.1uF  CAP0805  [0805]
C377  0.1uF  CAP0805  [0805]
C378  0.1uF  CAP0805  [0805]
C379  0.1uF  CAP0805  [0805]
C380  0.1uF  CAP0805  [0805]
C421  0.1uF  CAP0805  [0805]
C422  0.1uF  CAP0805  [0805]
C423  0.1uF  CAP0805  [0805]
C424  0.1uF  CAP0805  [0805]
C425  0.1uF  CAP0805  [0805]
C426  0.1uF  CAP0805  [0805]
C427  0.1uF  CAP0805  [0805]
C428  0.1uF  CAP0805  [0805]
C429  0.1uF  CAP0805  [0805]
C430  0.1uF  CAP0805  [0805]
C431  0.1uF  CAP0805  [0805]
C432  0.1uF  CAP0805  [0805]
C433  0.1uF  CAP0805  [0805]
C434  0.1uF  CAP0805  [0805]
C435  0.1uF  CAP0805  [0805]
C436  0.1uF  CAP0805  [0805]
C437  0.1uF  CAP0805  [0805]
C438  0.1uF  CAP0805  [0805]
C439  0.1uF  CAP0805  [0805]
C440  0.1uF  CAP0805  [0805]
C441  0.1uF  CAP0805  [0805]
C442  0.1uF  CAP0805  [0805]
C443  0.1uF  CAP0805  [0805]
C444  0.1uF  CAP0805  [0805]
C445  0.1uF  CAP0805  [0805]
C446  0.1uF  CAP0805  [0805]
C447  0.1uF  CAP0805  [0805]
C448  0.1uF  CAP0805  [0805]
C449  0.1uF  CAP0805  [0805]
C450  0.1uF  CAP0805  [0805]
C451  0.1uF  CAP0805  [0805]
C452  0.1uF  CAP0805  [0805]
C453  0.1uF  CAP0805  [0805]
C454  0.1uF  CAP0805  [0805]
C455  0.1uF  CAP0805  [0805]
C456  0.1uF  CAP0805  [0805]
C457  0.1uF  CAP0805  [0805]
C458  0.1uF  CAP0805  [0805]
C459  0.1uF  CAP0805  [0805]
C460  0.1uF  CAP0805  [0805]
C461  0.1uF  CAP0805  [0805]
C462  0.1uF  CAP0805  [0805]
C463  0.1uF  CAP0805  [0805]
C464  0.1uF  CAP0805  [0805]
C465  0.1uF  CAP0805  [0805]
C466  0.1uF  CAP0805  [0805]
C467  0.1uF  CAP0805  [0805]
C468  0.1uF  CAP0805  [0805]
C469  0.1uF  CAP0805  [0805]
C470  0.1uF  CAP0805  [0805]
C471  0.1uF  CAP0805  [0805]
C472  0.1uF  CAP0805  [0805]
C473  0.1uF  CAP0805  [0805]
C474  0.1uF  CAP0805  [0805]
C475  0.1uF  CAP0805  [0805]
C476  0.1uF  CAP0805  [0805]
C477  0.1uF  CAP0805  [0805]
C478  0.1uF  CAP0805  [0805]
C479  0.1uF  CAP0805  [0805]
C480  0.1uF  CAP0805  [0805]
C481  0.1uF  CAP0805  [0805]
C482  0.1uF  CAP0805  [0805]
C483  0.1uF  CAP0805  [0805]
C484  0.1uF  CAP0805  [0805]
C485  0.1uF  CAP0805  [0805]
C486  0.1uF  CAP0805  [0805]
C487  0.1uF  CAP0805  [0805]
C488  0.1uF  CAP0805  [0805]
C489  0.1uF  CAP0805  [0805]
C490  0.1uF  CAP0805  [0805]
C491  0.1uF  CAP0805  [0805]
C492  0.1uF  CAP0805  [0805]
C493  0.1uF  CAP0805  [0805]
C494  0.1uF  CAP0805  [0805]
C495  0.1uF  CAP0805  [0805]
C496  0.1uF  CAP0805  [0805]
C497  0.1uF  CAP0805  [0805]
C498  0.1uF  CAP0805  [0805]
C499  0.1uF  CAP0805  [0805]
C500  0.1uF  CAP0805  [0805]
C501  0.1uF  CAP0805  [0805]
C502  0.1uF  CAP0805  [0805]
C503  0.1uF  CAP0805  [0805]
C504  0.1uF  CAP0805  [0805]
C505  0.1uF  CAP0805  [0805]
C506  0.1uF  CAP0805  [0805]
C507  0.1uF  CAP0805  [0805]
C508  0.1uF  CAP0805  [0805]
C509  0.1uF  CAP0805  [0805]
C510  0.1uF  CAP0805  [0805]
C511  0.1uF  CAP0805  [0805]
C512  0.1uF  CAP0805  [0805]
C513  0.1uF  CAP0805  [0805]
C514  0.1uF  CAP0805  [0805]
C515  0.1uF  CAP0805  [0805]
C516  0.1uF  CAP0805  [0805]
C517  0.1uF  CAP0805  [0805]
C518  0.1uF  CAP0805  [0805]
C519  0.1uF  CAP0805  [0805]
C520  0.1uF  CAP0805  [0805]
C521  0.1uF  CAP0805  [0805]
C522  0.1uF  CAP0805  [0805]
C523  0.1uF  CAP0805  [0805]
C524  0.1uF  CAP0805  [0805]
C525  0.1uF  CAP0805  [0805]
C526  0.1uF  CAP0805  [0805]
C527  0.1uF  CAP0805  [0805]
C528  0.1uF  CAP0805  [0805]
C529  0.1uF  CAP0805  [0805]
C530  0.1uF  CAP0805  [0805]
C531  0.1uF  CAP0805  [0805]
C532  0.1uF  CAP0805  [0805]
C533  0.1uF  CAP0805  [0805]
C534  0.1uF  CAP0805  [0805]
C535  0.1uF  CAP0805  [0805]
C536  0.1uF  CAP0805  [0805]
C537  0.1uF  CAP0805  [0805]
C538  0.1uF  CAP0805  [0805]
C539  0.1uF  CAP0805  [0805]
C540  0.1uF  CAP0805  [0805]
C581  0.1uF  CAP0805  [0805]
C582  0.1uF  CAP0805  [0805]
C583  0.1uF  CAP0805  [0805]
C584  0.1uF  CAP0805  [0805]
C585  0.1uF  CAP0805  [0805]
C586  0.1uF  CAP0805  [0805]
C587  0.1uF  CAP0805  [0805]
C588  0.1uF  CAP0805  [0805]
C589  0.1uF  CAP0805  [0805]
C590  0.1uF  CAP0805  [0805]
C591  0.1uF  CAP0805  [0805]
C592  0.1uF  CAP0805  [0805]
C593  0.1uF  CAP0805  [0805]
C594  0.1uF  CAP0805  [0805]
C595  0.1uF  CAP0805  [0805]
C596  0.1uF  CAP0805  [0805]
C597  0.1uF  CAP0805  [0805]
C598  0.1uF  CAP0805  [0805]
C599  0.1uF  CAP0805  [0805]
C600  0.1uF  CAP0805  [0805]
C601  0.1uF  CAP0805  [0805]
C602  0.1uF  CAP0805  [0805]
C603  0.1uF  CAP0805  [0805]
C604  0.1uF  CAP0805  [0805]
C605  0.1uF  CAP0805  [0805]
C606  0.1uF  CAP0805  [0805]
C607  0.1uF  CAP0805  [0805]
C608  0.1uF  CAP0805  [0805]
C609  0.1uF  CAP0805  [0805]
C610  0.1uF  CAP0805  [0805]
C611  0.1uF  CAP0805  [0805]
C612  0.1uF  CAP0805  [0805]
C613  0.1uF  CAP0805  [0805]
C614  0.1uF  CAP0805  [0805]
C615  0.1uF  CAP0805  [0805]
C616  0.1uF  CAP0805  [0805]
C617  0.1uF  CAP0805  [0805]
C618  0.1uF  CAP0805  [0805]
C619  0.1uF  CAP0805  [0805]
C620  0.1uF  CAP0805  [0805]
C621  0.1uF  CAP0805  [0805]
C622  0.1uF  CAP0805  [0805]
C623  0.1uF  CAP0805  [0805]
C624  0.1uF  CAP0805  [0805]
C625  0.1uF  CAP0805  [0805]
C626  0.1uF  CAP0805  [0805]
C627  0.1uF  CAP0805  [0805]
C628  0.1uF  CAP0805  [0805]
C629  0.1uF  CAP0805  [0805]
C630  0.1uF  CAP0805  [0805]
C631  0.1uF  CAP0805  [0805]
C632  0.1uF  CAP0805  [0805]
C633  0.1uF  CAP0805  [0805]
C634  0.1uF  CAP0805  [0805]
C635  0.1uF  CAP0805  [0805]
C636  0.1uF  CAP0805  [0805]
C637  0.1uF  CAP0805  [0805]
C638  0.1uF  CAP0805  [0805]
C639  0.1uF  CAP0805  [0805]
C640  0.1uF  CAP0805  [0805]
C641  0.1uF  CAP0805  [0805]
C642  0.1uF  CAP0805  [0805]
C643  0.1uF  CAP0805  [0805]
C644  0.1uF  CAP0805  [0805]
C645  0.1uF  CAP0805  [0805]
C646  0.1uF  CAP0805  [0805]
C647  0.1uF  CAP0805  [0805]
C648  0.1uF  CAP0805  [0805]
C649  0.1uF  CAP0805  [0805]
C650  0.1uF  CAP0805  [0805]
C651  0.1uF  CAP0805  [0805]
C652  0.1uF  CAP0805  [0805]
C653  0.1uF  CAP0805  [0805]
C654  0.1uF  CAP0805  [0805]
C655  0.1uF  CAP0805  [0805]
C656  0.1uF  CAP0805  [0805]
C657  0.1uF  CAP0805  [0805]
C658  0.1uF  CAP0805  [0805]
C659  0.1uF  CAP0805  [0805]
C660  0.1uF  CAP0805  [0805]
C661  0.1uF  CAP0805  [0805]
C662  0.1uF  CAP0805  [0805]
C663  0.1uF  CAP0805  [0805]
C664  0.1uF  CAP0805  [0805]
C665  0.1uF  CAP0805  [0805]
C666  0.1uF  CAP0805  [0805]
C667  0.1uF  CAP0805  [0805]
C668  0.1uF  CAP0805  [0805]
C669  0.1uF  CAP0805  [0805]
C670  0.1uF  CAP0805  [0805]
C671  0.1uF  CAP0805  [0805]
C672  0.1uF  CAP0805  [0805]
C673  0.1uF  CAP0805  [0805]
C674  0.1uF  CAP0805  [0805]
C675  0.1uF  CAP0805  [0805]
C676  0.1uF  CAP0805  [0805]
C677  0.1uF  CAP0805  [0805]
C678  0.1uF  CAP0805  [0805]
C679  0.1uF  CAP0805  [0805]
C680  0.1uF  CAP0805  [0805]
C681  0.1uF  CAP0805  [0805]
C682  0.1uF  CAP0805  [0805]
C683  0.1uF  CAP0805  [0805]
C684  0.1uF  CAP0805  [0805]
C685  0.1uF  CAP0805  [0805]
C686  0.1uF  CAP0805  [0805]
C687  0.1uF  CAP0805  [0805]
C688  0.1uF  CAP0805  [0805]
C689  0.1uF  CAP0805  [0805]
C690  0.1uF  CAP0805  [0805]
C691  0.1uF  CAP0805  [0805]
C692  0.1uF  CAP0805  [0805]
C693  0.1uF  CAP0805  [0805]
C694  0.1uF  CAP0805  [0805]
C695  0.1uF  CAP0805  [0805]
C696  0.1uF  CAP0805  [0805]
C697  0.1uF  CAP0805  [0805]
C698  0.1uF  CAP0805  [0805]
C699  0.1uF  CAP0805  [0805]
C700  0.1uF  CAP0805  [0805]
C741  0.1uF  CAP0805  [0805]
C742  0.1uF  CAP0805  [0805]
C743  0.1uF  CAP0805  [0805]
C744  0.1uF  CAP0805  [0805]
C745  0.1uF  CAP0805  [0805]
C746  0.1uF  CAP0805  [0805]
C747  0.1uF  CAP0805  [0805]
C748  0.1uF  CAP0805  [0805]
C749  0.1uF  CAP0805  [0805]
C750  0.1uF  CAP0805  [0805]
C751  0.1uF  CAP0805  [0805]
C752  0.1uF  CAP0805  [0805]
C753  0.1uF  CAP0805  [0805]
C754  0.1uF  CAP0805  [0805]
C755  0.1uF  CAP0805  [0805]
C756  0.1uF  CAP0805  [0805]
C757  0.1uF  CAP0805  [0805]
C758  0.1uF  CAP0805  [0805]
C759  0.1uF  CAP0805  [0805]
C760  0.1uF  CAP0805  [0805]
C761  0.1uF  CAP0805  [0805]
C762  0.1uF  CAP0805  [0805]
C763  0.1uF  CAP0805  [0805]
C764  0.1uF  CAP0805  [0805]
C765  0.1uF  CAP0805  [0805]
C766  0.1uF  CAP0805  [0805]
C767  0.1uF  CAP0805  [0805]
C768  0.1uF  CAP0805  [0805]
C769  0.1uF  CAP0805  [0805]
C770  0.1uF  CAP0805  [0805]
C771  0.1uF  CAP0805  [0805]
C772  0.1uF  CAP0805  [0805]
C773  0.1uF  CAP0805  [0805]
C774  0.1uF  CAP0805  [0805]
C775  0.1uF  CAP0805  [0805]
C776  0.1uF  CAP0805  [0805]
C777  0.1uF  CAP0805  [0805]
C778  0.1uF  CAP0805  [0805]
C779  0.1uF  CAP0805  [0805]
C780  0.1uF  CAP0805  [0805]
C781  0.1uF  CAP0805  [0805]
C782  0.1uF  CAP0805  [0805]
C783  0.1uF  CAP0805  [0805]
C784  0.1uF  CAP0805  [0805]
C785  0.1uF  CAP0805  [0805]
C786  0.1uF  CAP0805  [0805]
C787  0.1uF  CAP0805  [0805]
C788  0.1uF  CAP0805  [0805]
C789  0.1uF  CAP0805  [0805]
C790  0.1uF  CAP0805  [0805]
C791  0.1uF  CAP0805  [0805]
C792  0.1uF  CAP0805  [0805]
C793  0.1uF  CAP0805  [0805]
C794  0.1uF  CAP0805  [0805]
C795  0.1uF  CAP0805  [0805]
C796  0.1uF  CAP0805  [0805]
C797  0.1uF  CAP0805  [0805]
C798  0.1uF  CAP0805  [0805]
C799  0.1uF  CAP0805  [0805]
C800  0.1uF  CAP0805  [0805]
C801  0.1uF  CAP0805  [0805]
C802  0.1uF  CAP0805  [0805]
C803  0.1uF  CAP0805  [0805]
C804  0.1uF  CAP0805  [0805]
C805  0.1uF  CAP0805  [0805]
C806  0.1uF  CAP0805  [0805]
C807  0.1uF  CAP0805  [0805]
C808  0.1uF  CAP0805  [0805]
C809  0.1uF  CAP0805  [0805]
C810  0.1uF  CAP0805  [0805]
C811  0.1uF  CAP0805  [0805]
C812  0.1uF  CAP0805  [0805]
C813  0.1uF  CAP0805  [0805]
C814  0.1uF  CAP0805  [0805]
C815  0.1uF  CAP0805  [0805]
C816  0.1uF  CAP0805  [0805]
C817  0.1uF  CAP0805  [0805]
C818  0.1uF  CAP0805  [0805]
C819  0.1uF  CAP0805  [0805]
C820  0.1uF  CAP0805  [0805]
C821  0.1uF  CAP0805  [0805]
C822  0.1uF  CAP0805  [0805]
C823  0.1uF  CAP0805  [0805]
C824  0.1uF  CAP0805  [0805]
C825  0.1uF  CAP0805  [0805]
C826  0.1uF  CAP0805  [0805]
C827  0.1uF  CAP0805  [0805]
C828  0.1uF  CAP0805  [0805]
C829  0.1uF  CAP0805  [0805]
C830  0.1uF  CAP0805  [0805]
C831  0.1uF  CAP0805  [0805]
C832  0.1uF  CAP0805  [0805]
C833  0.1uF  CAP0805  [0805]
C834  0.1uF  CAP0805  [0805]
C835  0.1uF  CAP0805  [0805]
C836  0.1uF  CAP0805  [0805]
C837  0.1uF  CAP0805  [0805]
C838  0.1uF  CAP0805  [0805]
C839  0.1uF  CAP0805  [0805]
C840  0.1uF  CAP0805  [0805]
C841  0.1uF  CAP0805  [0805]
C842  0.1uF  CAP0805  [0805]
C843  0.1uF  CAP0805  [0805]
C844  0.1uF  CAP0805  [0805]
C845  0.1uF  CAP0805  [0805]
C846  0.1uF  CAP0805  [0805]
C847  0.1uF  CAP0805  [0805]
C848  0.1uF  CAP0805  [0805]
C849  0.1uF  CAP0805  [0805]
C850  0.1uF  CAP0805  [0805]
C851  0.1uF  CAP0805  [0805]
C852  0.1uF  CAP0805  [0805]
C853  0.1uF  CAP0805  [0805]
C854  0.1uF  CAP0805  [0805]
C855  0.1uF  CAP0805  [0805]
C856  0.1uF  CAP0805  [0805]
C857  0.1uF  CAP0805  [0805]
C858  0.1uF  CAP0805  [0805]
C859  0.1uF  CAP0805  [0805]
C860  0.1uF  CAP0805  [0805]
C901  0.1uF  CAP0805  [0805]
C902  0.1uF  CAP0805  [0805]
C903  0.1uF  CAP0805  [0805]
C904  0.1uF  CAP0805  [0805]
C905  0.1uF  CAP0805  [0805]
C906  0.1uF  CAP0805  [0805]
C907  0.1uF  CAP0805  [0805]
C908  0.1uF  CAP0805  [0805]
C909  0.1uF  CAP0805  [0805]
C910  0.1uF  CAP0805  [0805]
C911  0.1uF  CAP0805  [0805]
C912  0.1uF  CAP0805  [0805]
C913  0.1uF  CAP0805  [0805]
C914  0.1uF  CAP0805  [0805]
C915  0.1uF  CAP0805  [0805]
C916  0.1uF  CAP0805  [0805]
C917  0.1uF  CAP0805  [0805]
C918  0.1uF  CAP0805  [0805]
C919  0.1uF  CAP0805  [0805]
C920  0.1uF  CAP0805  [0805]
C921  0.1uF  CAP0805  [0805]
C922  0.1uF  CAP0805  [0805]
C923  0.1uF  CAP0805  [0805]
C924  0.1uF  CAP0805  [0805]
C925  0.1uF  CAP0805  [0805]
C926  0.1uF  CAP0805  [0805]
C927  0.1uF  CAP0805  [0805]
C928  0.1uF  CAP0805  [0805]
C929  0.1uF  CAP0805  [0805]
C930  0.1uF  CAP0805  [0805]
C931  0.1uF  CAP0805  [0805]
C932  0.1uF  CAP0805  [0805]
C933  0.1uF  CAP0805  [0805]
C934  0.1uF  CAP0805  [0805]
C935  0.1uF  CAP0805  [0805]
C936  0.1uF  CAP0805  [0805]
C937  0.1uF  CAP0805  [0805]
C938  0.1uF  CAP0805  [0805]
C939  0.1uF  CAP0805  [0805]
C940  0.1uF  CAP0805  [0805]
C941  0.1uF  CAP0805  [0805]
C942  0.1uF  CAP0805  [0805]
C943  0.1uF  CAP0805  [0805]
C944  0.1uF  CAP0805  [0805]
C945  0.1uF  CAP0805  [0805]
C946  0.1uF  CAP0805  [0805]
C947  0.1uF  CAP0805  [0805]
C948  0.1uF  CAP0805  [0805]
C949  0.1uF  CAP0805  [0805]
C950  0.1uF  CAP0805  [0805]
C951  0.1uF  CAP0805  [0805]
C952  0.1uF  CAP0805  [0805]
C953  0.1uF  CAP0805  [0805]
C954  0.1uF  CAP0805  [0805]
C955  0.1uF  CAP0805  [0805]
C956  0.1uF  CAP0805  [0805]
C957  0.1uF  CAP0805  [0805]
C958  0.1uF  CAP0805  [0805]
C959  0.1uF  CAP0805  [0805]
C960  0.1uF  CAP0805  [0805]
C961  0.1uF  CAP0805  [0805]
C962  0.1uF  CAP0805  [0805]
C963  0.1uF  CAP0805  [0805]
C964  0.1uF  CAP0805  [0805]
C965  0.1uF  CAP0805  [0805]
C966  0.1uF  CAP0805  [0805]
C967  0.1uF  CAP0805  [0805]
C968  0.1uF  CAP0805  [0805]
C969  0.1uF  CAP0805  [0805]
C970  0.1uF  CAP0805  [0805]
C971  0.1uF  CAP0805  [0805]
C972  0.1uF  CAP0805  [0805]
C973  0.1uF  CAP0805  [0805]
C974  0.1uF  CAP0805  [0805]
C975  0.1uF  CAP0805  [0805]
C976  0.1uF  CAP0805  [0805]
C977  0.1uF  CAP0805  [0805]
C978  0.1uF  CAP0805  [0805]
C979  0.1uF  CAP0805  [0805]
C980  0.1uF  CAP0805  [0805]
C981  0.1uF  CAP0805  [0805]
C982  0.1uF  CAP0805  [0805]
C983  0.1uF  CAP0805  [0805]
C984  0.1uF  CAP0805  [0805]
C985  0.1uF  CAP0805  [0805]
C986  0.1uF  CAP0805  [0805]
C987  0.1uF  CAP0805  [0805]
C988  0.1uF  CAP0805  [0805]
C989  0.1uF  CAP0805  [0805]
C990  0.1uF  CAP0805  [0805]
C991  0.1uF  CAP0805  [0805]
C992  0.1uF  CAP0805  [0805]
C993  0.1uF  CAP0805  [0805]
C994  0.1uF  CAP0805  [0805]
C995  0.1uF  CAP0805  [0805]
C996  0.1uF  CAP0805  [0805]
C997  0.1uF  CAP0805  [0805]
C998  0.1uF  CAP0805  [0805]
C999  0.1uF  CAP0805  [0805]
C1000  0.1uF  CAP0805  [0805]
C1001  0.1uF  CAP0805  [0805]
C1002  0.1uF  CAP0805  [0805]
C1003  0.1uF  CAP0805  [0805]
C1004  0.1uF  CAP0805  [0805]
C1005  0.1uF  CAP0805  [0805]
C1006  0.1uF  CAP0805  [0805]
C1007  0.1uF  CAP0805  [0805]
C1008  0.1uF  CAP0805  [0805]
C1009  0.1uF  CAP0805  [0805]
C1010  0.1uF  CAP0805  [0805]
C1011  0.1uF  CAP0805  [0805]
C1012  0.1uF  CAP0805  [0805]
C1013  0.1uF  CAP0805  [0805]
C1014  0.1uF  CAP0805  [0805]
C1015  0.1uF  CAP0805  [0805]
C1016  0.1uF  CAP0805  [0805]
C1017  0.1uF  CAP0805  [0805]
C1018  0.1uF  CAP0805  [0805]
C1019  0.1uF  CAP0805  [0805]
C1020  0.1uF  CAP0805  [0805]
C1061  0.1uF  CAP0805  [0805]
C1062  0.1uF  CAP0805  [0805]
C1063  0.1uF  CAP0805  [0805]
C1064  0.1uF  CAP0805  [0805]
C1065  0.1uF  CAP0805  [0805]
C1066  0.1uF  CAP0805  [0805]
C1067  0.1uF  CAP0805  [0805]
C1068  0.1uF  CAP0805  [0805]
C1069  0.1uF  CAP0805  [0805]
C1070  0.1uF  CAP0805  [0805]
C1071  0.1uF  CAP0805  [0805]
C1072  0.1uF  CAP0805  [0805]
C1073  0.1uF  CAP0805  [0805]
C1074  0.1uF  CAP0805  [0805]
C1075  0.1uF  CAP0805  [0805]
C1076  0.1uF  CAP0805  [0805]
C1077  0.1uF  CAP0805  [0805]
C1078  0.1uF  CAP0805  [0805]
C1079  0.1uF  CAP0805  [0805]
C1080  0.1uF  CAP0805  [0805]
C1081  0.1uF  CAP0805  [0805]
C1082  0.1uF  CAP0805  [0805]
C1083  0.1uF  CAP0805  [0805]
C1084  0.1uF  CAP0805  [0805]
C1085  0.1uF  CAP0805  [0805]
C1086  0.1uF  CAP0805  [0805]
C1087  0.1uF  CAP0805  [0805]
C1088  0.1uF  CAP0805  [0805]
C1089  0.1uF  CAP0805  [0805]
C1090  0.1uF  CAP0805  [0805]
C1091  0.1uF  CAP0805  [0805]
C1092  0.1uF  CAP0805  [0805]
C1093  0.1uF  CAP0805  [0805]
C1094  0.1uF  CAP0805  [0805]
C1095  0.1uF  CAP0805  [0805]
C1096  0.1uF  CAP0805  [0805]
C1097  0.1uF  CAP0805  [0805]
C1098  0.1uF  CAP0805  [0805]
C1099  0.1uF  CAP0805  [0805]
C1100  0.1uF  CAP0805  [0805]
C1101  0.1uF  CAP0805  [0805]
C1102  0.1uF  CAP0805  [0805]
C1103  0.1uF  CAP0805  [0805]
C1104  0.1uF  CAP0805  [0805]
C1105  0.1uF  CAP0805  [0805]
C1106  0.1uF  CAP0805  [0805]
C1107  0.1uF  CAP0805  [0805]
C1108  0.1uF  CAP0805  [0805]
C1109  0.1uF  CAP0805  [0805]
C1110  0.1uF  CAP0805  [0805]
C1111  0.1uF  CAP0805  [0805]
C1112  0.1uF  CAP0805  [0805]
C1113  0.1uF  CAP0805  [0805]
C1114  0.1uF  CAP0805  [0805]
C1115  0.1uF  CAP0805  [0805]
C1116  0.1uF  CAP0805  [0805]
C1117  0.1uF  CAP0805  [0805]
C1118  0.1uF  CAP0805  [0805]
C1119  0.1uF  CAP0805  [0805]
C1120  0.1uF  CAP0805  [0805]
C1121  0.1uF  CAP0805  [0805]
C1122  0.1uF  CAP0805  [0805]
C1123  0.1uF  CAP0805  [0805]
C1124  0.1uF  CAP0805  [0805]
C1125  0.1uF  CAP0805  [0805]
C1126  0.1uF  CAP0805  [0805]
C1127  0.1uF  CAP0805  [0805]
C1128  0.1uF  CAP0805  [0805]
C1129  0.1uF  CAP0805  [0805]
C1130  0.1uF  CAP0805  [0805]
C1131  0.1uF  CAP0805  [0805]
C1132  0.1uF  CAP0805  [0805]
C1133  0.1uF  CAP0805  [0805]
C1134  0.1uF  CAP0805  [0805]
C1135  0.1uF  CAP0805  [0805]
C1136  0.1uF  CAP0805  [0805]
C1137  0.1uF  CAP0805  [0805]
C1138  0.1uF  CAP0805  [0805]
C1139  0.1uF  CAP0805  [0805]
C1140  0.1uF  CAP0805  [0805]
C1141  0.1uF  CAP0805  [0805]
C1142  0.1uF  CAP0805  [0805]
C1143  0.1uF  CAP0805  [0805]
C1144  0.1uF  CAP0805  [0805]
C1145  0.1uF  CAP0805  [0805]
C1146  0.1uF  CAP0805  [0805]
C1147  0.1uF  CAP0805  [0805]
C1148  0.1uF  CAP0805  [0805]
C1149  0.1uF  CAP0805  [0805]
C1150  0.1uF  CAP0805  [0805]
C1151  0.1uF  CAP0805  [0805]
C1152  0.1uF  CAP0805  [0805]
C1153  0.1uF  CAP0805  [0805]
C1154  0.1uF  CAP0805  [0805]
C1155  0.1uF  CAP0805  [0805]
C1156  0.1uF  CAP0805  [0805]
C1157  0.1uF  CAP0805  [0805]
C1158  0.1uF  CAP0805  [0805]
C1159  0.1uF  CAP0805  [0805]
C1160  0.1uF  CAP0805  [0805]
C1161  0.1uF  CAP0805  [0805]
C1162  0.1uF  CAP0805  [0805]
C1163  0.1uF  CAP0805  [0805]
C1164  0.1uF  CAP0805  [0805]
C1165  0.1uF  CAP0805  [0805]
C1166  0.1uF  CAP0805  [0805]
C1167  0.1uF  CAP0805  [0805]
C1168  0.1uF  CAP0805  [0805]
C1169  0.1uF  CAP0805  [0805]
C1170  0.1uF  CAP0805  [0805]
C1171  0.1uF  CAP0805  [0805]
C1172  0.1uF  CAP0805  [0805]
C1173  0.1uF  CAP0805  [0805]
C1174  0.1uF  CAP0805  [0805]
C1175  0.1uF  CAP0805  [0805]
C1176  0.1uF  CAP0805  [0805]
C1177  0.1uF  CAP0805  [0805]
C1178  0.1uF  CAP0805  [0805]
C1179  0.1uF  CAP0805  [0805]
C1180  0.1uF  CAP0805  [0805]
C1221  0.1uF  CAP0805  [0805]
C1222  0.1uF  CAP0805  [0805]
C1223  0.1uF  CAP0805  [0805]
C1224  0.1uF  CAP0805  [0805]
C1225  0.1uF  CAP0805  [0805]
C1226  0.1uF  CAP0805  [0805]
C1227  0.1uF  CAP0805  [0805]
C1228  0.1uF  CAP0805  [0805]
C1229  0.1uF  CAP0805  [0805]
C1230  0.1uF  CAP0805  [0805]
C1231  0.1uF  CAP0805  [0805]
C1232  0.1uF  CAP0805  [0805]
C1233  0.1uF  CAP0805  [0805]
C1234  0.1uF  CAP0805  [0805]
C1235  0.1uF  CAP0805  [0805]
C1236  0.1uF  CAP0805  [0805]
C1237  0.1uF  CAP0805  [0805]
C1238  0.1uF  CAP0805  [0805]
C1239  0.1uF  CAP0805  [0805]
C1240  0.1uF  CAP0805  [0805]
C1241  0.1uF  CAP0805  [0805]
C1242  0.1uF  CAP0805  [0805]
C1243  0.1uF  CAP0805  [0805]
C1244  0.1uF  CAP0805  [0805]
C1245  0.1uF  CAP0805  [0805]
C1246  0.1uF  CAP0805  [0805]
C1247  0.1uF  CAP0805  [0805]
C1248  0.1uF  CAP0805  [0805]
C1249  0.1uF  CAP0805  [0805]
C1250  0.1uF  CAP0805  [0805]
C1251  0.1uF  CAP0805  [0805]
C1252  0.1uF  CAP0805  [0805]
C1253  0.1uF  CAP0805  [0805]
C1254  0.1uF  CAP0805  [0805]
C1255  0.1uF  CAP0805  [0805]
C1256  0.1uF  CAP0805  [0805]
C1257  0.1uF  CAP0805  [0805]
C1258  0.1uF  CAP0805  [0805]
C1259  0.1uF  CAP0805  [0805]
C1260  0.1uF  CAP0805  [0805]
C1261  0.1uF  CAP0805  [0805]
C1262  0.1uF  CAP0805  [0805]
C1263  0.1uF  CAP0805  [0805]
C1264  0.1uF  CAP0805  [0805]
C1265  0.1uF  CAP0805  [0805]
C1266  0.1uF  CAP0805  [0805]
C1267  0.1uF  CAP0805  [0805]
C1268  0.1uF  CAP0805  [0805]
C1269  0.1uF  CAP0805  [0805]
C1270  0.1uF  CAP0805  [0805]
C1271  0.1uF  CAP0805  [0805]
C1272  0.1uF  CAP0805  [0805]
C1273  0.1uF  CAP0805  [0805]
C1274  0.1uF  CAP0805  [0805]
C1275  0.1uF  CAP0805  [0805]
C1276  0.1uF  CAP0805  [0805]
C1277  0.1uF  CAP0805  [0805]
C1278  0.1uF  CAP0805  [0805]
C1279  0.1uF  CAP0805  [0805]
C1280  0.1uF  CAP0805  [0805]
C1281  0.1uF  CAP0805  [0805]
C1282  0.1uF  CAP0805  [0805]
C1283  0.1uF  CAP0805  [0805]
C1284  0.1uF  CAP0805  [0805]
C1285  0.1uF  CAP0805  [0805]
C1286  0.1uF  CAP0805  [0805]
C1287  0.1uF  CAP0805  [0805]
C1288  0.1uF  CAP0805  [0805]
C1289  0.1uF  CAP0805  [0805]
C1290  0.1uF  CAP0805  [0805]
C1291  0.1uF  CAP0805  [0805]
C1292  0.1uF  CAP0805  [0805]
C1293  0.1uF  CAP0805  [0805]
C1294  0.1uF  CAP0805  [0805]
C1295  0.1uF  CAP0805  [0805]
C1296  0.1uF  CAP0805  [0805]
C1297  0.1uF  CAP0805  [0805]
C1298  0.1uF  CAP0805  [0805]
C1299  0.1uF  CAP0805  [0805]
C1300  0.1uF  CAP0805  [0805]
C1301  0.1uF  CAP0805  [0805]
C1302  0.1uF  CAP0805  [0805]
C1303  0.1uF  CAP0805  [0805]
C1304  0.1uF  CAP0805  [0805]
C1305  0.1uF  CAP0805  [0805]
C1306  0.1uF  CAP0805  [0805]
C1307  0.1uF  CAP0805  [0805]
C1308  0.1uF  CAP0805  [0805]
C1309  0.1uF  CAP0805  [0805]
C1310  0.1uF  CAP0805  [0805]
C1311  0.1uF  CAP0805  [0805]
C1312  0.1uF  CAP0805  [0805]
C1313  0.1uF  CAP0805  [0805]
C1314  0.1uF  CAP0805  [0805]
C1315  0.1uF  CAP0805  [0805]
C1316  0.1uF  CAP0805  [0805]
C1317  0.1uF  CAP0805  [0805]
C1318  0.1uF  CAP0805  [0805]
C1319  0.1uF  CAP0805  [0805]
C1320  0.1uF  CAP0805  [0805]
C1321  0.1uF  CAP0805  [0805]
C1322  0.1uF  CAP0805  [0805]
C1323  0.1uF  CAP0805  [0805]
C1324  0.1uF  CAP0805  [0805]
C1325  0.1uF  CAP0805  [0805]
C1326  0.1uF  CAP0805  [0805]
C1327  0.1uF  CAP0805  [0805]
C1328  0.1uF  CAP0805  [0805]
C1329  0.1uF  CAP0805  [0805]
C1330  0.1uF  CAP0805  [0805]
C1331  0.1uF  CAP0805  [0805]
C1332  0.1uF  CAP0805  [0805]
C1333  0.1uF  CAP0805  [0805]
C1334  0.1uF  CAP0805  [0805]
C1335  0.1uF  CAP0805  [0805]
C1336  0.1uF  CAP0805  [0805]
C1337  0.1uF  CAP0805  [0805]
C1338  0.1uF  CAP0805  [0805]
C1339  0.1uF  CAP0805  [0805]
C1340  0.1uF  CAP0805  [0805]
C1381  0.1uF  CAP0805  [0805]
C1382  0.1uF  CAP0805  [0805]
C1383  0.1uF  CAP0805  [0805]
C1384  0.1uF  CAP0805  [0805]
C1385  0.1uF  CAP0805  [0805]
C1386  0.1uF  CAP0805  [0805]
C1387  0.1uF  CAP0805  [0805]
C1388  0.1uF  CAP0805  [0805]
C1389  0.1uF  CAP0805  [0805]
C1390  0.1uF  CAP0805  [0805]
C1391  0.1uF  CAP0805  [0805]
C1392  0.1uF  CAP0805  [0805]
C1393  0.1uF  CAP0805  [0805]
C1394  0.1uF  CAP0805  [0805]
C1395  0.1uF  CAP0805  [0805]
C1396  0.1uF  CAP0805  [0805]
C1397  0.1uF  CAP0805  [0805]
C1398  0.1uF  CAP0805  [0805]
C1399  0.1uF  CAP0805  [0805]
C1400  0.1uF  CAP0805  [0805]
C1401  0.1uF  CAP0805  [0805]
C1402  0.1uF  CAP0805  [0805]
C1403  0.1uF  CAP0805  [0805]
C1404  0.1uF  CAP0805  [0805]
C1405  0.1uF  CAP0805  [0805]
C1406  0.1uF  CAP0805  [0805]
C1407  0.1uF  CAP0805  [0805]
C1408  0.1uF  CAP0805  [0805]
C1409  0.1uF  CAP0805  [0805]
C1410  0.1uF  CAP0805  [0805]
C1411  0.1uF  CAP0805  [0805]
C1412  0.1uF  CAP0805  [0805]
C1413  0.1uF  CAP0805  [0805]
C1414  0.1uF  CAP0805  [0805]
C1415  0.1uF  CAP0805  [0805]
C1416  0.1uF  CAP0805  [0805]
C1417  0.1uF  CAP0805  [0805]
C1418  0.1uF  CAP0805  [0805]
C1419  0.1uF  CAP0805  [0805]
C1420  0.1uF  CAP0805  [0805]
C1421  0.1uF  CAP0805  [0805]
C1422  0.1uF  CAP0805  [0805]
C1423  0.1uF  CAP0805  [0805]
C1424  0.1uF  CAP0805  [0805]
C1425  0.1uF  CAP0805  [0805]
C1426  0.1uF  CAP0805  [0805]
C1427  0.1uF  CAP0805  [0805]
C1428  0.1uF  CAP0805  [0805]
C1429  0.1uF  CAP0805  [0805]
C1430  0.1uF  CAP0805  [0805]
C1431  0.1uF  CAP0805  [0805]
C1432  0.1uF  CAP0805  [0805]
C1433  0.1uF  CAP0805  [0805]
C1434  0.1uF  CAP0805  [0805]
C1435  0.1uF  CAP0805  [0805]
C1436  0.1uF  CAP0805  [0805]
C1437  0.1uF  CAP0805  [0805]
C1438  0.1uF  CAP0805  [0805]
C1439  0.1uF  CAP0805  [0805]
C1440  0.1uF  CAP0805  [0805]
C1441  0.1uF  CAP0805  [0805]
C1442  0.1uF  CAP0805  [0805]
C1443  0.1uF  CAP0805  [0805]
C1444  0.1uF  CAP0805  [0805]
C1445  0.1uF  CAP0805  [0805]
C1446  0.1uF  CAP0805  [0805]
C1447  0.1uF  CAP0805  [0805]
C1448  0.1uF  CAP0805  [0805]
C1449  0.1uF  CAP0805  [0805]
C1450  0.1uF  CAP0805  [0805]
C1451  0.1uF  CAP0805  [0805]
C1452  0.1uF  CAP0805  [0805]
C1453  0.1uF  CAP0805  [0805]
C1454  0.1uF  CAP0805  [0805]
C1455  0.1uF  CAP0805  [0805]
C1456  0.1uF  CAP0805  [0805]
C1457  0.1uF  CAP0805  [0805]
C1458  0.1uF  CAP0805  [0805]
C1459  0.1uF  CAP0805  [0805]
C1460  0.1uF  CAP0805  [0805]
C1461  0.1uF  CAP0805  [0805]
C1462  0.1uF  CAP0805  [0805]
C1463  0.1uF  CAP0805  [0805]
C1464  0.1uF  CAP0805  [0805]
C1465  0.1uF  CAP0805  [0805]
C1466  0.1uF  CAP0805  [0805]
C1467  0.1uF  CAP0805  [0805]
C1468  0.1uF  CAP0805  [0805]
C1469  0.1uF  CAP0805  [0805]
C1470  0.1uF  CAP0805  [0805]
C1471  0.1uF  CAP0805  [0805]
C1472  0.1uF  CAP0805  [0805]
C1473  0.1uF  CAP0805  [0805]
C1474  0.1uF  CAP0805  [0805]
C1475  0.1uF  CAP0805  [0805]
C1476  0.1uF  CAP0805  [0805]
C1477  0.1uF  CAP0805  [0805]
C1478  0.1uF  CAP0805  [0805]
C1479  0.1uF  CAP0805  [0805]
C1480  0.1uF  CAP0805  [0805]
C1481  0.1uF  CAP0805  [0805]
C1482  0.1uF  CAP0805  [0805]
C1483  0.1uF  CAP0805  [0805]
C1484  0.1uF  CAP0805  [0805]
C1485  0.1uF  CAP0805  [0805]
C1486  0.1uF  CAP0805  [0805]
C1487  0.1uF  CAP0805  [0805]
C1488  0.1uF  CAP0805  [0805]
C1489  0.1uF  CAP0805  [0805]
C1490  0.1uF  CAP0805  [0805]
C1491  0.1uF  CAP0805  [0805]
C1492  0.1uF  CAP0805  [0805]
C1493  0.1uF  CAP0805  [0805]
C1494  0.1uF  CAP0805  [0805]
C1495  0.1uF  CAP0805  [0805]
C1496  0.1uF  CAP0805  [0805]
C1497  0.1uF  CAP0805  [0805]
C1498  0.1uF  CAP0805  [0805]
C1499  0.1uF  CAP0805  [0805]
C1500  0.1uF  CAP0805  [0805]
C1541  0.1uF  CAP0805  [0805]
C1542  0.1uF  CAP0805  [0805]
C1543  0.1uF  CAP0805  [0805]
C1544  0.1uF  CAP0805  [0805]
C1545  0.1uF  CAP0805  [0805]
C1546  0.1uF  CAP0805  [0805]
C1547  0.1uF  CAP0805  [0805]
C1548  0.1uF  CAP0805  [0805]
C1549  0.1uF  CAP0805  [0805]
C1550  0.1uF  CAP0805  [0805]
C1551  0.1uF  CAP0805  [0805]
C1552  0.1uF  CAP0805  [0805]
C1553  0.1uF  CAP0805  [0805]
C1554  0.1uF  CAP0805  [0805]
C1555  0.1uF  CAP0805  [0805]
C1556  0.1uF  CAP0805  [0805]
C1557  0.1uF  CAP0805  [0805]
C1558  0.1uF  CAP0805  [0805]
C1559  0.1uF  CAP0805  [0805]
C1560  0.1uF  CAP0805  [0805]
C1561  0.1uF  CAP0805  [0805]
C1562  0.1uF  CAP0805  [0805]
C1563  0.1uF  CAP0805  [0805]
C1564  0.1uF  CAP0805  [0805]
C1565  0.1uF  CAP0805  [0805]
C1566  0.1uF  CAP0805  [0805]
C1567  0.1uF  CAP0805  [0805]
C1568  0.1uF  CAP0805  [0805]
C1569  0.1uF  CAP0805  [0805]
C1570  0.1uF  CAP0805  [0805]
C1571  0.1uF  CAP0805  [0805]
C1572  0.1uF  CAP0805  [0805]
C1573  0.1uF  CAP0805  [0805]
C1574  0.1uF  CAP0805  [0805]
C1575  0.1uF  CAP0805  [0805]
C1576  0.1uF  CAP0805  [0805]
C1577  0.1uF  CAP0805  [0805]
C1578  0.1uF  CAP0805  [0805]
C1579  0.1uF  CAP0805  [0805]
C1580  0.1uF  CAP0805  [0805]
C1581  0.1uF  CAP0805  [0805]
C1582  0.1uF  CAP0805  [0805]
C1583  0.1uF  CAP0805  [0805]
C1584  0.1uF  CAP0805  [0805]
C1585  0.1uF  CAP0805  [0805]
C1586  0.1uF  CAP0805  [0805]
C1587  0.1uF  CAP0805  [0805]
C1588  0.1uF  CAP0805  [0805]
C1589  0.1uF  CAP0805  [0805]
C1590  0.1uF  CAP0805  [0805]
C1591  0.1uF  CAP0805  [0805]
C1592  0.1uF  CAP0805  [0805]
C1593  0.1uF  CAP0805  [0805]
C1594  0.1uF  CAP0805  [0805]
C1595  0.1uF  CAP0805  [0805]
C1596  0.1uF  CAP0805  [0805]
C1597  0.1uF  CAP0805  [0805]
C1598  0.1uF  CAP0805  [0805]
C1599  0.1uF  CAP0805  [0805]
C1600  0.1uF  CAP0805  [0805]
C1601  0.1uF  CAP0805  [0805]
C1602  0.1uF  CAP0805  [0805]
C1603  0.1uF  CAP0805  [0805]
C1604  0.1uF  CAP0805  [0805]
C1605  0.1uF  CAP0805  [0805]
C1606  0.1uF  CAP0805  [0805]
C1607  0.1uF  CAP0805  [0805]
C1608  0.1uF  CAP0805  [0805]
C1609  0.1uF  CAP0805  [0805]
C1610  0.1uF  CAP0805  [0805]
C1611  0.1uF  CAP0805  [0805]
C1612  0.1uF  CAP0805  [0805]
C1613  0.1uF  CAP0805  [0805]
C1614  0.1uF  CAP0805  [0805]
C1615  0.1uF  CAP0805  [0805]
C1616  0.1uF  CAP0805  [0805]
C1617  0.1uF  CAP0805  [0805]
C1618  0.1uF  CAP0805  [0805]
C1619  0.1uF  CAP0805  [0805]
C1620  0.1uF  CAP0805  [0805]
C1621  0.1uF  CAP0805  [0805]
C1622  0.1uF  CAP0805  [0805]
C1623  0.1uF  CAP0805  [0805]
C1624  0.1uF  CAP0805  [0805]
C1625  0.1uF  CAP0805  [0805]
C1626  0.1uF  CAP0805  [0805]
C1627  0.1uF  CAP0805  [0805]
C1628  0.1uF  CAP0805  [0805]
C1629  0.1uF  CAP0805  [0805]
C1630  0.1uF  CAP0805  [0805]
C1631  0.1uF  CAP0805  [0805]
C1632  0.1uF  CAP0805  [0805]
C1633  0.1uF  CAP0805  [0805]
C1634  0.1uF  CAP0805  [0805]
C1635  0.1uF  CAP0805  [0805]
C1636  0.1uF  CAP0805  [0805]
C1637  0.1uF  CAP0805  [0805]
C1638  0.1uF  CAP0805  [0805]
C1639  0.1uF  CAP0805  [0805]
C1640  0.1uF  CAP0805  [0805]
C1641  0.1uF  CAP0805  [0805]
C1642  0.1uF  CAP0805  [0805]
C1643  0.1uF  CAP0805  [0805]
C1644  0.1uF  CAP0805  [0805]
C1645  0.1uF  CAP0805  [0805]
C1646  0.1uF  CAP0805  [0805]
C1647  0.1uF  CAP0805  [0805]
C1648  0.1uF  CAP0805  [0805]
C1649  0.1uF  CAP0805  [0805]
C1650  0.1uF  CAP0805  [0805]
C1651  0.1uF  CAP0805  [0805]
C1652  0.1uF  CAP0805  [0805]
C1653  0.1uF  CAP0805  [0805]
C1654  0.1uF  CAP0805  [0805]
C1655  0.1uF  CAP0805  [0805]
C1656  0.1uF  CAP0805  [0805]
C1657  0.1uF  CAP0805  [0805]
C1658  0.1uF  CAP0805  [0805]
C1659  0.1uF  CAP0805  [0805]
C1660  0.1uF  CAP0805  [0805]
C1701  0.1uF  CAP0805  [0805]
C1702  0.1uF  CAP0805  [0805]
C1703  0.1uF  CAP0805  [0805]
C1704  0.1uF  CAP0805  [0805]
C1705  0.1uF  CAP0805  [0805]
C1706  0.1uF  CAP0805  [0805]
C1707  0.1uF  CAP0805  [0805]
C1708  0.1uF  CAP0805  [0805]
C1709  0.1uF  CAP0805  [0805]
C1710  0.1uF  CAP0805  [0805]
C1711  0.1uF  CAP0805  [0805]
C1712  0.1uF  CAP0805  [0805]
C1713  0.1uF  CAP0805  [0805]
C1714  0.1uF  CAP0805  [0805]
C1715  0.1uF  CAP0805  [0805]
C1716  0.1uF  CAP0805  [0805]
C1717  0.1uF  CAP0805  [0805]
C1718  0.1uF  CAP0805  [0805]
C1719  0.1uF  CAP0805  [0805]
C1720  0.1uF  CAP0805  [0805]
C1721  0.1uF  CAP0805  [0805]
C1722  0.1uF  CAP0805  [0805]
C1723  0.1uF  CAP0805  [0805]
C1724  0.1uF  CAP0805  [0805]
C1725  0.1uF  CAP0805  [0805]
C1726  0.1uF  CAP0805  [0805]
C1727  0.1uF  CAP0805  [0805]
C1728  0.1uF  CAP0805  [0805]
C1729  0.1uF  CAP0805  [0805]
C1730  0.1uF  CAP0805  [0805]
C1731  0.1uF  CAP0805  [0805]
C1732  0.1uF  CAP0805  [0805]
C1733  0.1uF  CAP0805  [0805]
C1734  0.1uF  CAP0805  [0805]
C1735  0.1uF  CAP0805  [0805]
C1736  0.1uF  CAP0805  [0805]
C1737  0.1uF  CAP0805  [0805]
C1738  0.1uF  CAP0805  [0805]
C1739  0.1uF  CAP0805  [0805]
C1740  0.1uF  CAP0805  [0805]
C1741  0.1uF  CAP0805  [0805]
C1742  0.1uF  CAP0805  [0805]
C1743  0.1uF  CAP0805  [0805]
C1744  0.1uF  CAP0805  [0805]
C1745  0.1uF  CAP0805  [0805]
C1746  0.1uF  CAP0805  [0805]
C1747  0.1uF  CAP0805  [0805]
C1748  0.1uF  CAP0805  [0805]
C1749  0.1uF  CAP0805  [0805]
C1750  0.1uF  CAP0805  [0805]
C1751  0.1uF  CAP0805  [0805]
C1752  0.1uF  CAP0805  [0805]
C1753  0.1uF  CAP0805  [0805]
C1754  0.1uF  CAP0805  [0805]
C1755  0.1uF  CAP0805  [0805]
C1756  0.1uF  CAP0805  [0805]
C1757  0.1uF  CAP0805  [0805]
C1758  0.1uF  CAP0805  [0805]
C1759  0.1uF  CAP0805  [0805]
C1760  0.1uF  CAP0805  [0805]
C1761  0.1uF  CAP0805  [0805]
C1762  0.1uF  CAP0805  [0805]
C1763  0.1uF  CAP0805  [0805]
C1764  0.1uF  CAP0805  [0805]
C1765  0.1uF  CAP0805  [0805]
C1766  0.1uF  CAP0805  [0805]
C1767  0.1uF  CAP0805  [0805]
C1768  0.1uF  CAP0805  [0805]
C1769  0.1uF  CAP0805  [0805]
C1770  0.1uF  CAP0805  [0805]
C1771  0.1uF  CAP0805  [0805]
C1772  0.1uF  CAP0805  [0805]
C1773  0.1uF  CAP0805  [0805]
C1774  0.1uF  CAP0805  [0805]
C1775  0.1uF  CAP0805  [0805]
C1776  0.1uF  CAP0805  [0805]
C1777  0.1uF  CAP0805  [0805]
C1778  0.1uF  CAP0805  [0805]
C1779  0.1uF  CAP0805  [0805]
C1780  0.1uF  CAP0805  [0805]
C1781  0.1uF  CAP0805  [0805]
C1782  0.1uF  CAP0805  [0805]
C1783  0.1uF  CAP0805  [0805]
C1784  0.1uF  CAP0805  [0805]
C1785  0.1uF  CAP0805  [0805]
C1786  0.1uF  CAP0805  [0805]
C1787  0.1uF  CAP0805  [0805]
C1788  0.1uF  CAP0805  [0805]
C1789  0.1uF  CAP0805  [0805]
C1790  0.1uF  CAP0805  [0805]
C1791  0.1uF  CAP0805  [0805]
C1792  0.1uF  CAP0805  [0805]
C1793  0.1uF  CAP0805  [0805]
C1794  0.1uF  CAP0805  [0805]
C1795  0.1uF  CAP0805  [0805]
C1796  0.1uF  CAP0805  [0805]
C1797  0.1uF  CAP0805  [0805]
C1798  0.1uF  CAP0805  [0805]
C1799  0.1uF  CAP0805  [0805]
C1800  0.1uF  CAP0805  [0805]
C1801  0.1uF  CAP0805  [0805]
C1802  0.1uF  CAP0805  [0805]
C1803  0.1uF  CAP0805  [0805]
C1804  0.1uF  CAP0805  [0805]
C1805  0.1uF  CAP0805  [0805]
C1806  0.1uF  CAP0805  [0805]
C1807  0.1uF  CAP0805  [0805]
C1808  0.1uF  CAP0805  [0805]
C1809  0.1uF  CAP0805  [0805]
C1810  0.1uF  CAP0805  [0805]
C1811  0.1uF  CAP0805  [0805]
C1812  0.1uF  CAP0805  [0805]
C1813  0.1uF  CAP0805  [0805]
C1814  0.1uF  CAP0805  [0805]
C1815  0.1uF  CAP0805  [0805]
C1816  0.1uF  CAP0805  [0805]
C1817  0.1uF  CAP0805  [0805]
C1818  0.1uF  CAP0805  [0805]
C1819  0.1uF  CAP0805  [0805]
C1820  0.1uF  CAP0805  [0805]
C1861  0.1uF  CAP0805  [0805]
C1862  0.1uF  CAP0805  [0805]
C1863  0.1uF  CAP0805  [0805]
C1864  0.1uF  CAP0805  [0805]
C1865  0.1uF  CAP0805  [0805]
C1866  0.1uF  CAP0805  [0805]
C1867  0.1uF  CAP0805  [0805]
C1868  0.1uF  CAP0805  [0805]
C1869  0.1uF  CAP0805  [0805]
C1870  0.1uF  CAP0805  [0805]
C1871  0.1uF  CAP0805  [0805]
C1872  0.1uF  CAP0805  [0805]
C1873  0.1uF  CAP0805  [0805]
C1874  0.1uF  CAP0805  [0805]
C1875  0.1uF  CAP0805  [0805]
C1876  0.1uF  CAP0805  [0805]
C1877  0.1uF  CAP0805  [0805]
C1878  0.1uF  CAP0805  [0805]
C1879  0.1uF  CAP0805  [0805]
C1880  0.1uF  CAP0805  [0805]
C1881  0.1uF  CAP0805  [0805]
C1882  0.1uF  CAP0805  [0805]
C1883  0.1uF  CAP0805  [0805]
C1884  0.1uF  CAP0805  [0805]
C1885  0.1uF  CAP0805  [0805]
C1886  0.1uF  CAP0805  [0805]
C1887  0.1uF  CAP0805  [0805]
C1888  0.1uF  CAP0805  [0805]
C1889  0.1uF  CAP0805  [0805]
C1890  0.1uF  CAP0805  [0805]
C1891  0.1uF  CAP0805  [0805]
C1892  0.1uF  CAP0805  [0805]
C1893  0.1uF  CAP0805  [0805]
C1894  0.1uF  CAP0805  [0805]
C1895  0.1uF  CAP0805  [0805]
C1896  0.1uF  CAP0805  [0805]
C1897  0.1uF  CAP0805  [0805]
C1898  0.1uF  CAP0805  [0805]
C1899  0.1uF  CAP0805  [0805]
C1900  0.1uF  CAP0805  [0805]
C1901  0.1uF  CAP0805  [0805]
C1902  0.1uF  CAP0805  [0805]
C1903  0.1uF  CAP0805  [0805]
C1904  0.1uF  CAP0805  [0805]
C1905  0.1uF  CAP0805  [0805]
C1906  0.1uF  CAP0805  [0805]
C1907  0.1uF  CAP0805  [0805]
C1908  0.1uF  CAP0805  [0805]
C1909  0.1uF  CAP0805  [0805]
C1910  0.1uF  CAP0805  [0805]
C1911  0.1uF  CAP0805  [0805]
C1912  0.1uF  CAP0805  [0805]
C1913  0.1uF  CAP0805  [0805]
C1914  0.1uF  CAP0805  [0805]
C1915  0.1uF  CAP0805  [0805]
C1916  0.1uF  CAP0805  [0805]
C1917  0.1uF  CAP0805  [0805]
C1918  0.1uF  CAP0805  [0805]
C1919  0.1uF  CAP0805  [0805]
C1920  0.1uF  CAP0805  [0805]
C1921  0.1uF  CAP0805  [0805]
C1922  0.1uF  CAP0805  [0805]
C1923  0.1uF  CAP0805  [0805]
C1924  0.1uF  CAP0805  [0805]
C1925  0.1uF  CAP0805  [0805]
C1926  0.1uF  CAP0805  [0805]
C1927  0.1uF  CAP0805  [0805]
C1928  0.1uF  CAP0805  [0805]
C1929  0.1uF  CAP0805  [0805]
C1930  0.1uF  CAP0805  [0805]
C1931  0.1uF  CAP0805  [0805]
C1932  0.1uF  CAP0805  [0805]
C1933  0.1uF  CAP0805  [0805]
C1934  0.1uF  CAP0805  [0805]
C1935  0.1uF  CAP0805  [0805]
C1936  0.1uF  CAP0805  [0805]
C1937  0.1uF  CAP0805  [0805]
C1938  0.1uF  CAP0805  [0805]
C1939  0.1uF  CAP0805  [0805]
C1940  0.1uF  CAP0805  [0805]
C1941  0.1uF  CAP0805  [0805]
C1942  0.1uF  CAP0805  [0805]
C1943  0.1uF  CAP0805  [0805]
C1944  0.1uF  CAP0805  [0805]
C1945  0.1uF  CAP0805  [0805]
C1946  0.1uF  CAP0805  [0805]
C1947  0.1uF  CAP0805  [0805]
C1948  0.1uF  CAP0805  [0805]
C1949  0.1uF  CAP0805  [0805]
C1950  0.1uF  CAP0805  [0805]
C1951  0.1uF  CAP0805  [0805]
C1952  0.1uF  CAP0805  [0805]
C1953  0.1uF  CAP0805  [0805]
C1954  0.1uF  CAP0805  [0805]
C1955  0.1uF  CAP0805  [0805]
C1956  0.1uF  CAP0805  [0805]
C1957  0.1uF  CAP0805  [0805]
C1958  0.1uF  CAP0805  [0805]
C1959  0.1uF  CAP0805  [0805]
C1960  0.1uF  CAP0805  [0805]
C1961  0.1uF  CAP0805  [0805]
C1962  0.1uF  CAP0805  [0805]
C1963  0.1uF  CAP0805  [0805]
C1964  0.1uF  CAP0805  [0805]
C1965  0.1uF  CAP0805  [0805]
C1966  0.1uF  CAP0805  [0805]
C1967  0.1uF  CAP0805  [0805]
C1968  0.1uF  CAP0805  [0805]
C1969  0.1uF  CAP0805  [0805]
C1970  0.1uF  CAP0805  [0805]
C1971  0.1uF  CAP0805  [0805]
C1972  0.1uF  CAP0805  [0805]
C1973  0.1uF  CAP0805  [0805]
C1974  0.1uF  CAP0805  [0805]
C1975  0.1uF  CAP0805  [0805]
C1976  0.1uF  CAP0805  [0805]
C1977  0.1uF  CAP0805  [0805]
C1978  0.1uF  CAP0805  [0805]
C1979  0.1uF  CAP0805  [0805]
C1980  0.1uF  CAP0805  [0805]
C2021  0.1uF  CAP0805  [0805]
C2022  0.1uF  CAP0805  [0805]
C2023  0.1uF  CAP0805  [0805]
C2024  0.1uF  CAP0805  [0805]
C2025  0.1uF  CAP0805  [0805]
C2026  0.1uF  CAP0805  [0805]
C2027  0.1uF  CAP0805  [0805]
C2028  0.1uF  CAP0805  [0805]
C2029  0.1uF  CAP0805  [0805]
C2030  0.1uF  CAP0805  [0805]
C2031  0.1uF  CAP0805  [0805]
C2032  0.1uF  CAP0805  [0805]
C2033  0.1uF  CAP0805  [0805]
C2034  0.1uF  CAP0805  [0805]
C2035  0.1uF  CAP0805  [0805]
C2036  0.1uF  CAP0805  [0805]
C2037  0.1uF  CAP0805  [0805]
C2038  0.1uF  CAP0805  [0805]
C2039  0.1uF  CAP0805  [0805]
C2040  0.1uF  CAP0805  [0805]
C2041  0.1uF  CAP0805  [0805]
C2042  0.1uF  CAP0805  [0805]
C2043  0.1uF  CAP0805  [0805]
C2044  0.1uF  CAP0805  [0805]
C2045  0.1uF  CAP0805  [0805]
C2046  0.1uF  CAP0805  [0805]
C2047  0.1uF  CAP0805  [0805]
C2048  0.1uF  CAP0805  [0805]
C2049  0.1uF  CAP0805  [0805]
C2050  0.1uF  CAP0805  [0805]
C2051  0.1uF  CAP0805  [0805]
C2052  0.1uF  CAP0805  [0805]
C2053  0.1uF  CAP0805  [0805]
C2054  0.1uF  CAP0805  [0805]
C2055  0.1uF  CAP0805  [0805]
C2056  0.1uF  CAP0805  [0805]
C2057  0.1uF  CAP0805  [0805]
C2058  0.1uF  CAP0805  [0805]
C2059  0.1uF  CAP0805  [0805]
C2060  0.1uF  CAP0805  [0805]
C2061  0.1uF  CAP0805  [0805]
C2062  0.1uF  CAP0805  [0805]
C2063  0.1uF  CAP0805  [0805]
C2064  0.1uF  CAP0805  [0805]
C2065  0.1uF  CAP0805  [0805]
C2066  0.1uF  CAP0805  [0805]
C2067  0.1uF  CAP0805  [0805]
C2068  0.1uF  CAP0805  [0805]
C2069  0.1uF  CAP0805  [0805]
C2070  0.1uF  CAP0805  [0805]
C2071  0.1uF  CAP0805  [0805]
C2072  0.1uF  CAP0805  [0805]
C2073  0.1uF  CAP0805  [0805]
C2074  0.1uF  CAP0805  [0805]
C2075  0.1uF  CAP0805  [0805]
C2076  0.1uF  CAP0805  [0805]
C2077  0.1uF  CAP0805  [0805]
C2078  0.1uF  CAP0805  [0805]
C2079  0.1uF  CAP0805  [0805]
C2080  0.1uF  CAP0805  [0805]
C2081  0.1uF  CAP0805  [0805]
C2082  0.1uF  CAP0805  [0805]
C2083  0.1uF  CAP0805  [0805]
C2084  0.1uF  CAP0805  [0805]
C2085  0.1uF  CAP0805  [0805]
C2086  0.1uF  CAP0805  [0805]
C2087  0.1uF  CAP0805  [0805]
C2088  0.1uF  CAP0805  [0805]
C2089  0.1uF  CAP0805  [0805]
C2090  0.1uF  CAP0805  [0805]
C2091  0.1uF  CAP0805  [0805]
C2092  0.1uF  CAP0805  [0805]
C2093  0.1uF  CAP0805  [0805]
C2094  0.1uF  CAP0805  [0805]
C2095  0.1uF  CAP0805  [0805]
C2096  0.1uF  CAP0805  [0805]
C2097  0.1uF  CAP0805  [0805]
C2098  0.1uF  CAP0805  [0805]
C2099  0.1uF  CAP0805  [0805]
C2100  0.1uF  CAP0805  [0805]
C2101  0.1uF  CAP0805  [0805]
C2102  0.1uF  CAP0805  [0805]
C2103  0.1uF  CAP0805  [0805]
C2104  0.1uF  CAP0805  [0805]
C2105  0.1uF  CAP0805  [0805]
C2106  0.1uF  CAP0805  [0805]
C2107  0.1uF  CAP0805  [0805]
C2108  0.1uF  CAP0805  [0805]
C2109  0.1uF  CAP0805  [0805]
C2110  0.1uF  CAP0805  [0805]
C2111  0.1uF  CAP0805  [0805]
C2112  0.1uF  CAP0805  [0805]
C2113  0.1uF  CAP0805  [0805]
C2114  0.1uF  CAP0805  [0805]
C2115  0.1uF  CAP0805  [0805]
C2116  0.1uF  CAP0805  [0805]
C2117  0.1uF  CAP0805  [0805]
C2118  0.1uF  CAP0805  [0805]
C2119  0.1uF  CAP0805  [0805]
C2120  0.1uF  CAP0805  [0805]
C2121  0.1uF  CAP0805  [0805]
C2122  0.1uF  CAP0805  [0805]
C2123  0.1uF  CAP0805  [0805]
C2124  0.1uF  CAP0805  [0805]
C2125  0.1uF  CAP0805  [0805]
C2126  0.1uF  CAP0805  [0805]
C2127  0.1uF  CAP0805  [0805]
C2128  0.1uF  CAP0805  [0805]
C2129  0.1uF  CAP0805  [0805]
C2130  0.1uF  CAP0805  [0805]
C2131  0.1uF  CAP0805  [0805]
C2132  0.1uF  CAP0805  [0805]
C2133  0.1uF  CAP0805  [0805]
C2134  0.1uF  CAP0805  [0805]
C2135  0.1uF  CAP0805  [0805]
C2136  0.1uF  CAP0805  [0805]
C2137  0.1uF  CAP0805  [0805]
C2138  0.1uF  CAP0805  [0805]
C2139  0.1uF  CAP0805  [0805]
C2140  0.1uF  CAP0805  [0805]
C2181  0.1uF  CAP0805  [0805]
C2182  0.1uF  CAP0805  [0805]
C2183  0.1uF  CAP0805  [0805]
C2184  0.1uF  CAP0805  [0805]
C2185  0.1uF  CAP0805  [0805]
C2186  0.1uF  CAP0805  [0805]
C2187  0.1uF  CAP0805  [0805]
C2188  0.1uF  CAP0805  [0805]
C2189  0.1uF  CAP0805  [0805]
C2190  0.1uF  CAP0805  [0805]
C2191  0.1uF  CAP0805  [0805]
C2192  0.1uF  CAP0805  [0805]
C2193  0.1uF  CAP0805  [0805]
C2194  0.1uF  CAP0805  [0805]
C2195  0.1uF  CAP0805  [0805]
C2196  0.1uF  CAP0805  [0805]
C2197  0.1uF  CAP0805  [0805]
C2198  0.1uF  CAP0805  [0805]
C2199  0.1uF  CAP0805  [0805]
C2200  0.1uF  CAP0805  [0805]
C2201  0.1uF  CAP0805  [0805]
C2202  0.1uF  CAP0805  [0805]
C2203  0.1uF  CAP0805  [0805]
C2204  0.1uF  CAP0805  [0805]
C2205  0.1uF  CAP0805  [0805]
C2206  0.1uF  CAP0805  [0805]
C2207  0.1uF  CAP0805  [0805]
C2208  0.1uF  CAP0805  [0805]
C2209  0.1uF  CAP0805  [0805]
C2210  0.1uF  CAP0805  [0805]
C2211  0.1uF  CAP0805  [0805]
C2212  0.1uF  CAP0805  [0805]
C2213  0.1uF  CAP0805  [0805]
C2214  0.1uF  CAP0805  [0805]
C2215  0.1uF  CAP0805  [0805]
C2216  0.1uF  CAP0805  [0805]
C2217  0.1uF  CAP0805  [0805]
C2218  0.1uF  CAP0805  [0805]
C2219  0.1uF  CAP0805  [0805]
C2220  0.1uF  CAP0805  [0805]
C2221  0.1uF  CAP0805  [0805]
C2222  0.1uF  CAP0805  [0805]
C2223  0.1uF  CAP0805  [0805]
C2224  0.1uF  CAP0805  [0805]